# Altium project BRR_CB_P03_REV_A1_1-STM32MP157.PrjPcb (part 2 of 3)

## Sheet PowerSupply.SchDoc
size A3; SheetNumber: 6; SheetTotal: 14
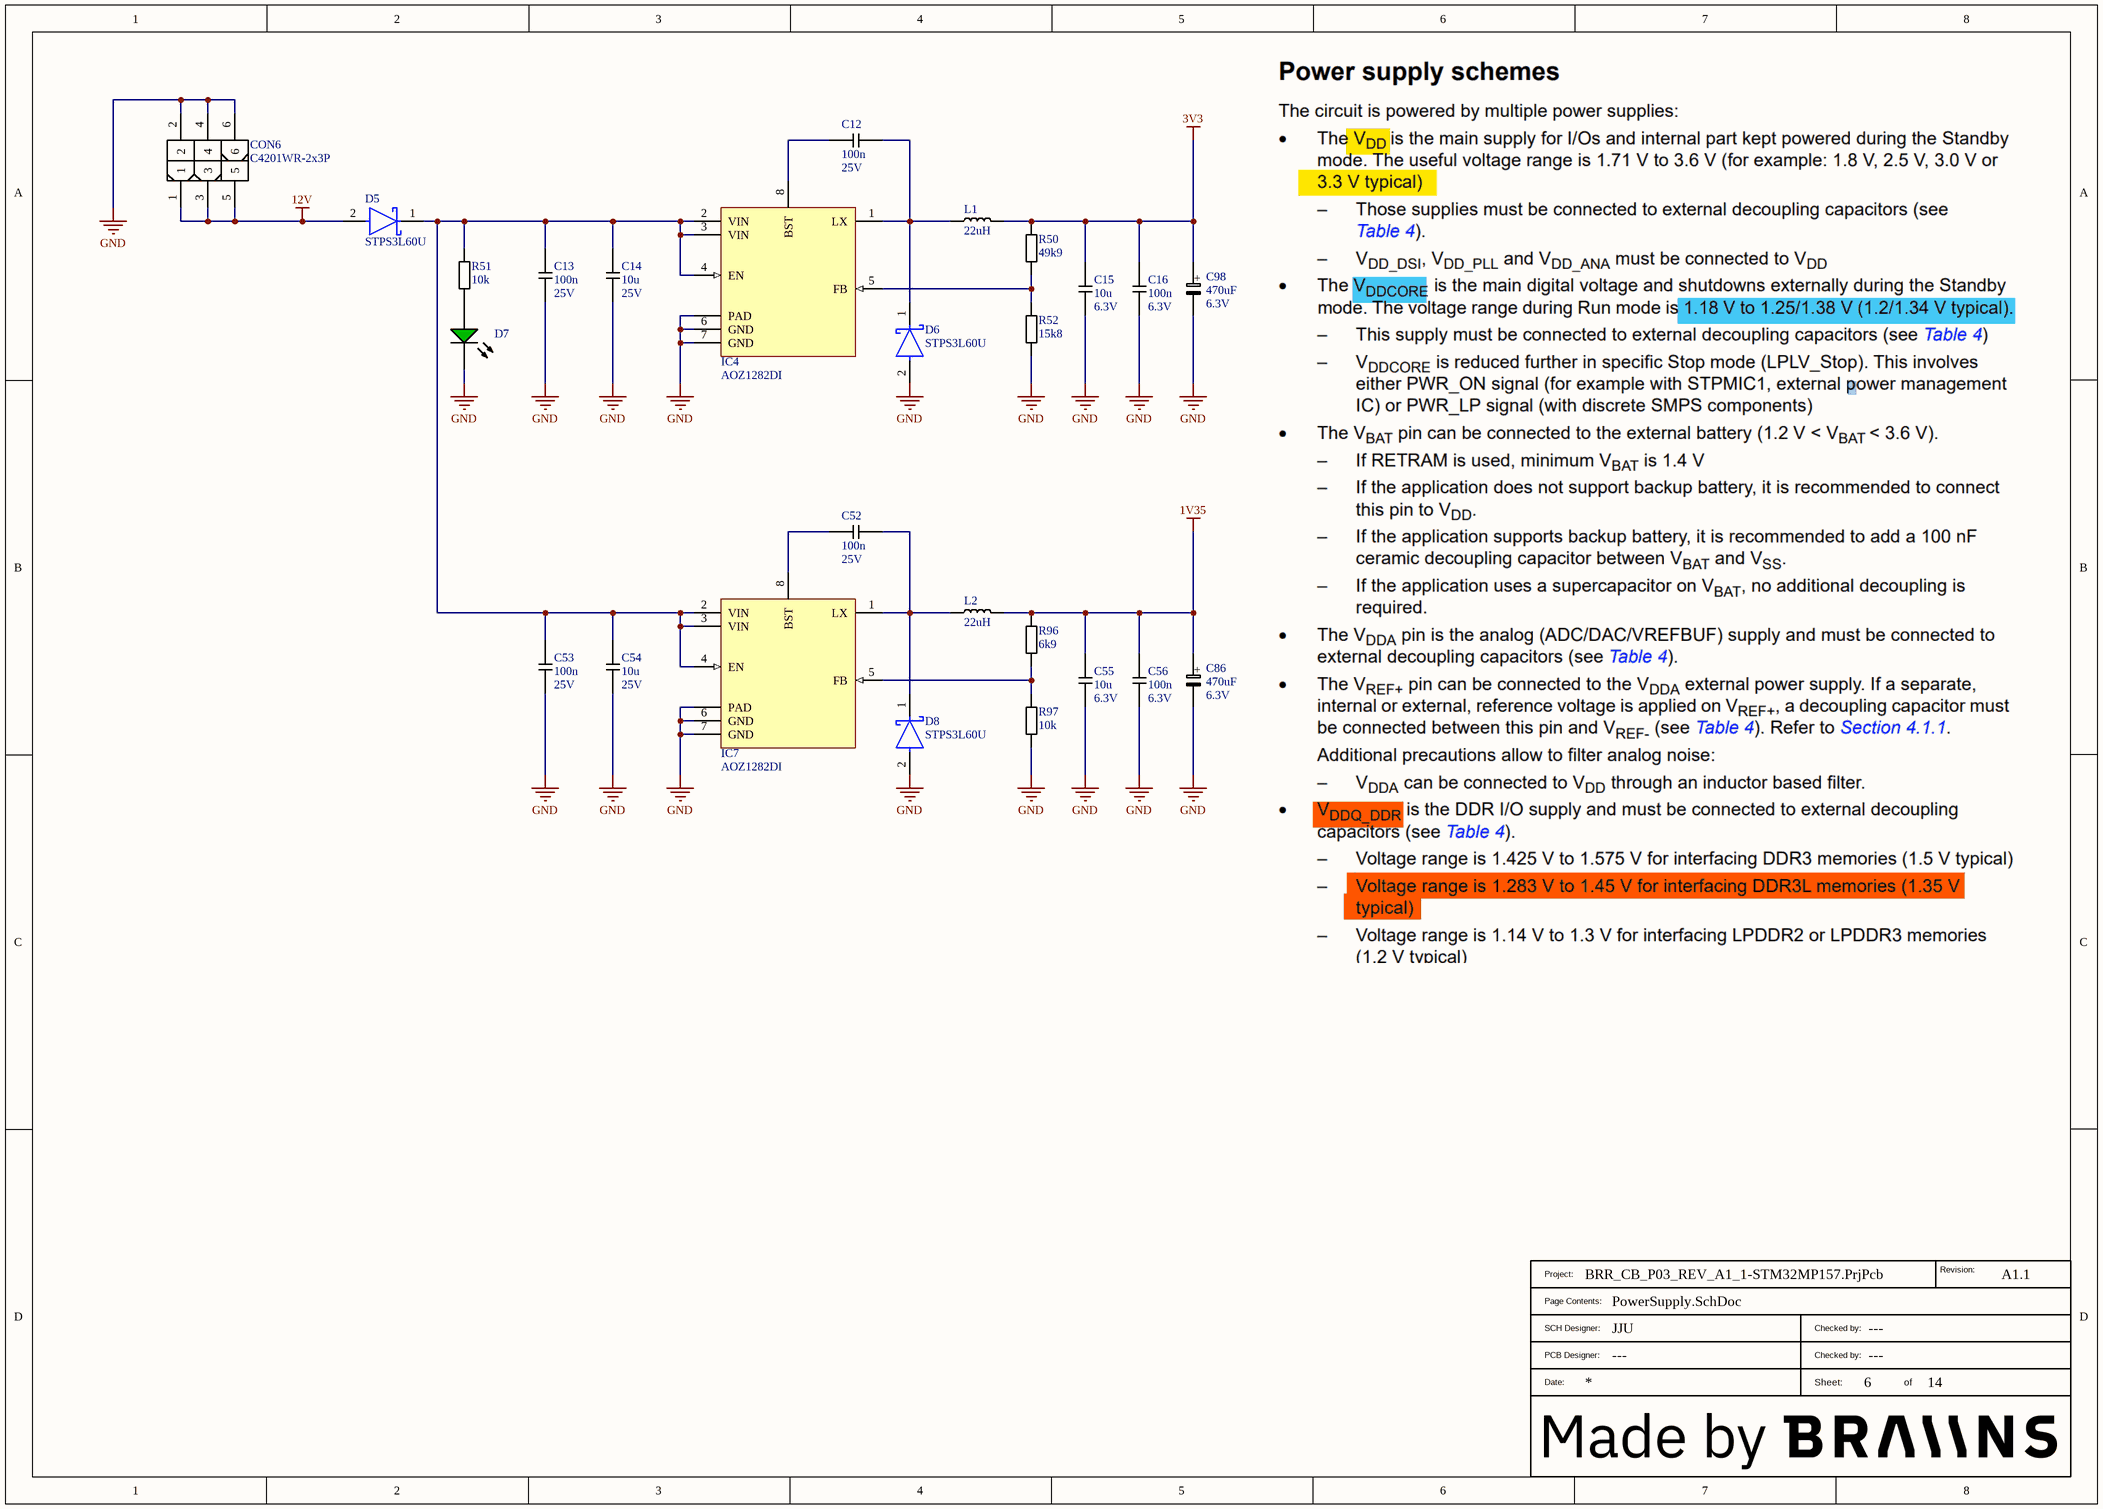
[diagram p4: PowerSupply.SchDoc]

### Parts
(Parts that share a designator on the sheet are numbered #1, #2 ... from top to bottom, then left to right.)
?#5  BraiinsTitleBlockWithLogo  (value not drawn)  (graphical)
C12  Voltage_Rating: 25V  [CAP0603]  (hidden comment: 100n)
C13  Voltage_Rating: 25V  [CAP0603]  (hidden comment: 100n)
C14  Voltage_Rating: 25V  [CAP1206]  (hidden comment: 10u)
C15  Voltage_Rating: 6.3V  [CAP0805]  (hidden comment: 10u)
C16  Voltage_Rating: 6.3V  [CAP0402]  (hidden comment: 100n)
C52  Voltage_Rating: 25V  [CAP0603]  (hidden comment: 100n)
C53  Voltage_Rating: 25V  [CAP0603]  (hidden comment: 100n)
C54  Voltage_Rating: 25V  [CAP1206]  (hidden comment: 10u)
C55  Voltage_Rating: 6.3V  [CAP0805]  (hidden comment: 10u)
C56  Voltage_Rating: 6.3V  [CAP0402]  (hidden comment: 100n)
C86  Voltage_Rating: 6.3V  [CAP_EEEFTJ471XAP]  (hidden comment: 470uF)
C98  Voltage_Rating: 6.3V  [CAP_EEEFTJ471XAP]  (hidden comment: 470uF)
CON6  C4201WR-2x3P  [MOLEX_39301061]
D5  STPS3L60U  [FP-SMB-MFG]
D6  STPS3L60U  [FP-SMB-MFG]
D7  FYLS-0603UGC  [AVAG-HSMX-C190_V]  (value not drawn)
D8  STPS3L60U  [FP-SMB-MFG]
IC4  AOZ1282DI  [DFN8_2X2]
IC7  AOZ1282DI  [DFN8_2X2]
L1  22uH  [VLS5045EX]
L2  22uH  [VLS5045EX]
R50  49k9  [RES0402]
R51  10k  [RES0603]
R52  15k8  [RES0402]
R96  6k9  [RES0402]
R97  10k  [RES0402]

### Nets
1V35: C55.1 C56.1 C86.1 L2.2 R96.1
3V3: C15.1 C16.1 C98.1 L1.2 R50.1
12V: CON6.1 CON6.3 CON6.5 D5.2(A)
GND: C13.2 C14.2 C15.2 C16.2 C53.2 C54.2 C55.2 C56.2 C86.2 C98.2 CON6.2 CON6.4 CON6.6 D6.2(A) D7.2(K) D8.2(A) IC4.6(GND) IC4.7(GND) IC4.PAD IC7.6(GND) IC7.7(GND) IC7.PAD R52.2 R97.2
NetC12_1: C12.1 IC4.8(BST)
NetC12_2: C12.2 D6.1(K) IC4.1(LX) L1.1
NetC13_1: C13.1 C14.1 C53.1 C54.1 D5.1(K) IC4.2(VIN) IC4.3(VIN) IC4.4(EN) IC7.2(VIN) IC7.3(VIN) IC7.4(EN) R51.1
NetC52_1: C52.1 IC7.8(BST)
NetC52_2: C52.2 D8.1(K) IC7.1(LX) L2.1
NetD7_1: D7.1(A) R51.2
NetIC4_5: IC4.5(FB) R50.2 R52.1
NetIC7_5: IC7.5(FB) R96.2 R97.1

### Notes on the sheet
- (in symbol 30239) +
- (in symbol BraiinsTitleBlockWithLogo) Revision:; Project:; Page Contents:; SCH Designer:; Checked by:; PCB Designer:; Date:; Sheet:; of

### Library data of the parts
C12 C13 C52 C53 = 30172: CAP CER 100n 10% 25V X7R 0603; Part_Type: Capacitor; Part_Status: New; ID: 30172; Updated By: janjuranek; Sorted_Value: 100; Value: 100n; Sub_Type: CER; Manufacturer Part Description: CAP CER 100n 10% 25V X7R 0603; Package_Case: 0603; RoHS: Yes; Dielectric: X7R; Tolerance: 10%; Created By: janjuranek; Created_Date: 2023-05-02 16:34:01; Updated_Date: 2023-05-02 16:34:23; ComponentLink1Description: Datasheet; ComponentLink2Description: Supplier Part Details
C14 C54 = 30171: CAP CER 10u 10% 25V X7R 1206; Part_Type: Capacitor; Part_Status: New; ID: 30171; Updated By: janjuranek; Sorted_Value: 10; Value: 10u; Sub_Type: CER; Manufacturer Part Description: CAP CER 10u 10% 25V X7R 1206; Package_Case: 1206; Dielectric: X7R; Tolerance: 10%; Created By: janjuranek; Created_Date: 2023-05-02 15:32:51; Updated_Date: 2023-05-02 15:37:12; ComponentLink1Description: Datasheet; ComponentLink2Description: Supplier Part Details
C15 C55 = 30174: CAP CER 10u 10% 6.3V X7R 0805; Part_Type: Capacitor; Part_Status: New; ID: 30174; Updated By: janjuranek; Sorted_Value: 10; Value: 10u; Sub_Type: CER; Manufacturer Part Description: CAP CER 10u 10% 6.3V X7R 0805; Package_Case: 0805; Dielectric: X7R; Tolerance: 10%; Created By: janjuranek; Created_Date: 2023-05-09 02:18:46; Updated_Date: 2023-05-09 02:19:22; ComponentLink1Description: Datasheet; ComponentLink2Description: Supplier Part Details; RoHS: Yes
C16 C56 = 30154: CAP CER 100n 10% 6.3V 0402; Part_Type: Capacitor; Part_Status: New; ID: 30154; Dielectric: X7R; Updated By: janjuranek; Sorted_Value: 100; Value: 100n; Sub_Type: CER; Manufacturer Part Description: CAP CER 100n 10% 6.3V 0402; Package_Case: 0402; RoHS: Yes; Tolerance: 10%; Created By: janjuranek; Created_Date: 2023-05-01 19:17:49; Updated_Date: 2023-05-01 19:19:14; ComponentLink1Description: Datasheet; ComponentLink2Description: Supplier Part Details
C86 C98 = 30239: CAP ELECT 470uF ±20% 6.3V Radial, Can - SMD; Part_Type: Capacitor; Manufacturer Part Number: EEE-FTJ471XAP; Manufacturer: Panasonic Electronic Components; Part_Status: New; ID: 30239; Sub_Type: POL; Updated By: janjuranek; Sorted_Value: 0,00047; Value: 470uF; Manufacturer Part Description: CAP ELECT 470uF ±20% 6.3V Radial, Can - SMD; Supplier 1: Digi-Key; Supplier Part Number 1: P15096TR-ND; Package_Case: Radial, Can - SMD; RoHS: Yes; Temperature Range: -55C to +105C; Tolerance: ±20%; Created By: janjuranek; Created_Date: 2023-10-13 11:39:12; Updated_Date: 2023-10-13 11:39:46; ComponentLink1Description: Datasheet; ComponentLink2Description: Supplier Part Details; ComponentLink2URL: https://www.digikey.com/products/en?keywords=EEE-FTJ471XAP
CON6 = 30196: CB Power Supply Connector; Manufacturer: CJT; Part_Status: New; ID: 30196; Updated By: janjuranek; Value: C4201WR-2x3P; Part_Type: Connector; Manufacturer Part Number: C4201WR-2x3P; Manufacturer Part Description: CB Power Supply Connector; Package_Case: THT; RoHS: Yes; Created By: janjuranek; Created_Date: 2023-06-06 15:12:03; Updated_Date: 2023-06-06 15:13:00; ComponentLink1Description: Datasheet; ComponentLink2Description: Supplier Part Details
D5 D6 D8 = CMP-12187-000023-1: DIODE SCHOTTKY 60V 3A SMB; Manufacturer: STMicroelectronics; Standoff Height: 0.05mm; Peak Reverse Current: 150uA; Max Junction Temp: +150°C; Max Surge Forward Current: 100A; Octopart: https://octopart.com/stps3l60u-stmicroelectronics-334329; Category: Diode; Height: 2.65mm; RoHS: TRUE; Mouser Description: Schottky diode Configuration: Single Housing type: DO-214AA=SMB Peak conducting-state current: 100 A; Forward Current: 3A; Manufacturer Part Number: STPS3L60U; Temperature: to +150°C; ComponentLink2URL: https://www.st.com/resource/en/datasheet/stps3l60.pdf; Max Repetitive Reverse Voltage: 60V; Device Class L1: Discrete Semiconductors; Automotive: No; Device Class L3: Schottky Diodes; Digikey Description: DIODE SCHOTTKY 60V 3A SMB; Lead Free: Yes; Temperature Range High: +150°C; Package: SMB; ComponentLink2Description: Datasheet; Device Class L2: Diodes
D7 = CMP-007-00013-2: LED Uni-Color Green, 52 mW, 20 mA, -40 to 85 degC, 2-Pin SMD, RoHS, Tape and Reel; Manufacturer: Avago; Forward Current: 20mA; Viewing Angle: 170degrees; Luminous Intensity: 15mcd; Lens Style: Diffused; Forward Voltage: 2.2V; Power: 52mW; Mounting Technology: SM; RoHS Compliant: True; Packaging: TapeandReel; Illumination Colour: Green; Datasheet URL: http://docs.avagotech.com/docs/AV02-0551EN; Min Operating Temperature: -40°C; Max Operating Temperature: 85°C; Pins: 2; Package Description: 2-Pin Surface Mount Device, Body 1.6 x 0.8 mm, Height 0.9 mm; Nominal Vf: 2.2V; Case/Package: 0603; Manufacturer URL: http://www.avagotech.com/; Datasheet Version: Mar-12; Colour: Green; Package Reference: HSMX-C190; Package Quantity: 4000
IC4 IC7 = 30108: 1.2A buck regulator, 4.5V to 36V, 450kHz; Part_Type: IC; Manufacturer: Alpha & Omeha; Part_Status: New; ID: 30108; Updated By: janjuranek; Value: AOZ1282DI; Manufacturer Part Number: AOZ1282DI; Manufacturer Part Description: 1.2A buck regulator, 4.5V to 36V, 450kHz; Package_Case: DFN8_2x2; RoHS: Yes; Created By: janjuranek; Created_Date: 2023-03-15 10:24:18; Updated_Date: 2023-03-15 10:26:02; ComponentLink1Description: Datasheet; ComponentLink2Description: Supplier Part Details
L1 L2 = 30147: INDUCTOR 22uH ±20% 1.8A; Manufacturer Part Number: VLS5045EX-220M-H; Manufacturer: TDK Corporation; Part_Status: New; ID: 30147; Updated By: janjuranek; Sorted_Value: 2,2E-5; Value: 22uH; Part_Type: Inductor; Manufacturer Part Description: INDUCTOR 22uH ±20% 1.8A; Supplier 1: Digi-Key; Supplier Part Number 1: 445-181623-2-ND; RoHS: Yes; Temperature Range: -40C to +125C; Tolerance: ±20%; Current_Rating: 1.8A; Created By: janjuranek; Created_Date: 2023-04-25 13:27:45; Updated_Date: 2023-04-25 13:28:20; ComponentLink1Description: Datasheet; ComponentLink2Description: Supplier Part Details; ComponentLink2URL: https://www.digikey.com/products/en?keywords=VLS5045EX-220M-H
R50 = 30164: RES 49k9 Ohm 1% 0402; Part_Status: New; ID: 30164; Updated By: janjuranek; Sorted_Value: 49; Value: 49k9; Part_Type: Resistor; Manufacturer Part Description: RES 49k9 Ohm 1% 0402; Package_Case: 0402; RoHS: Yes; Tolerance: 1%; Created By: janjuranek; Created_Date: 2023-05-01 19:45:19; Updated_Date: 2023-05-01 19:45:33; ComponentLink1Description: Datasheet; ComponentLink2Description: Supplier Part Details
R51 = 30092: RES 10k Ohm 1% 0603; Part_Status: New; ID: 30092; Updated By: janjuranek; Sorted_Value: 10000; Value: 10k; Part_Type: Resistor; Manufacturer Part Description: RES 10k Ohm 1% 0603; Package_Case: 0603; RoHS: Yes; Tolerance: 1%; Created By: janjuranek; Created_Date: 2023-03-07 16:44:40; Updated_Date: 2023-03-07 16:45:08; ComponentLink1Description: Datasheet; ComponentLink2Description: Supplier Part Details
R52 = 30165: RES 15k8 Ohm 1% 0402; Part_Status: New; ID: 30165; Updated By: janjuranek; Sorted_Value: 15; Value: 15k8; Part_Type: Resistor; Manufacturer Part Description: RES 15k8 Ohm 1% 0402; Package_Case: 0402; RoHS: Yes; Tolerance: 1%; Created By: janjuranek; Created_Date: 2023-05-01 19:45:37; Updated_Date: 2023-05-01 19:45:52; ComponentLink1Description: Datasheet; ComponentLink2Description: Supplier Part Details
R96 = 30153: RES 6k9 Ohm 1% 0402; Part_Status: New; ID: 30153; Updated By: janjuranek; Sorted_Value: 6; Value: 6k9; Part_Type: Resistor; Manufacturer Part Description: RES 6k9 Ohm 1% 0402; Package_Case: 0402; RoHS: Yes; Tolerance: 1%; Created By: janjuranek; Created_Date: 2023-05-01 18:44:43; Updated_Date: 2023-05-01 18:45:19; ComponentLink1Description: Datasheet; ComponentLink2Description: Supplier Part Details
R97 = 30071: RES 10k Ohm 1% 0402; Part_Status: New; ID: 30071; Updated By: Jan; Sorted_Value: 10000; Value: 10k; Part_Type: Resistor; Manufacturer Part Description: RES 10k Ohm 1% 0402; Package_Case: 0402; RoHS: Yes; Tolerance: 1%; Created By: Jan; Created_Date: 2023-03-02 13:13:56; Updated_Date: 2023-03-02 13:14:31; ComponentLink1Description: Datasheet; ComponentLink2Description: Supplier Part Details; Temperature Range: -40 to +150C

## Sheet SDCard.SchDoc
size A4; SheetNumber: 5; SheetTotal: 14
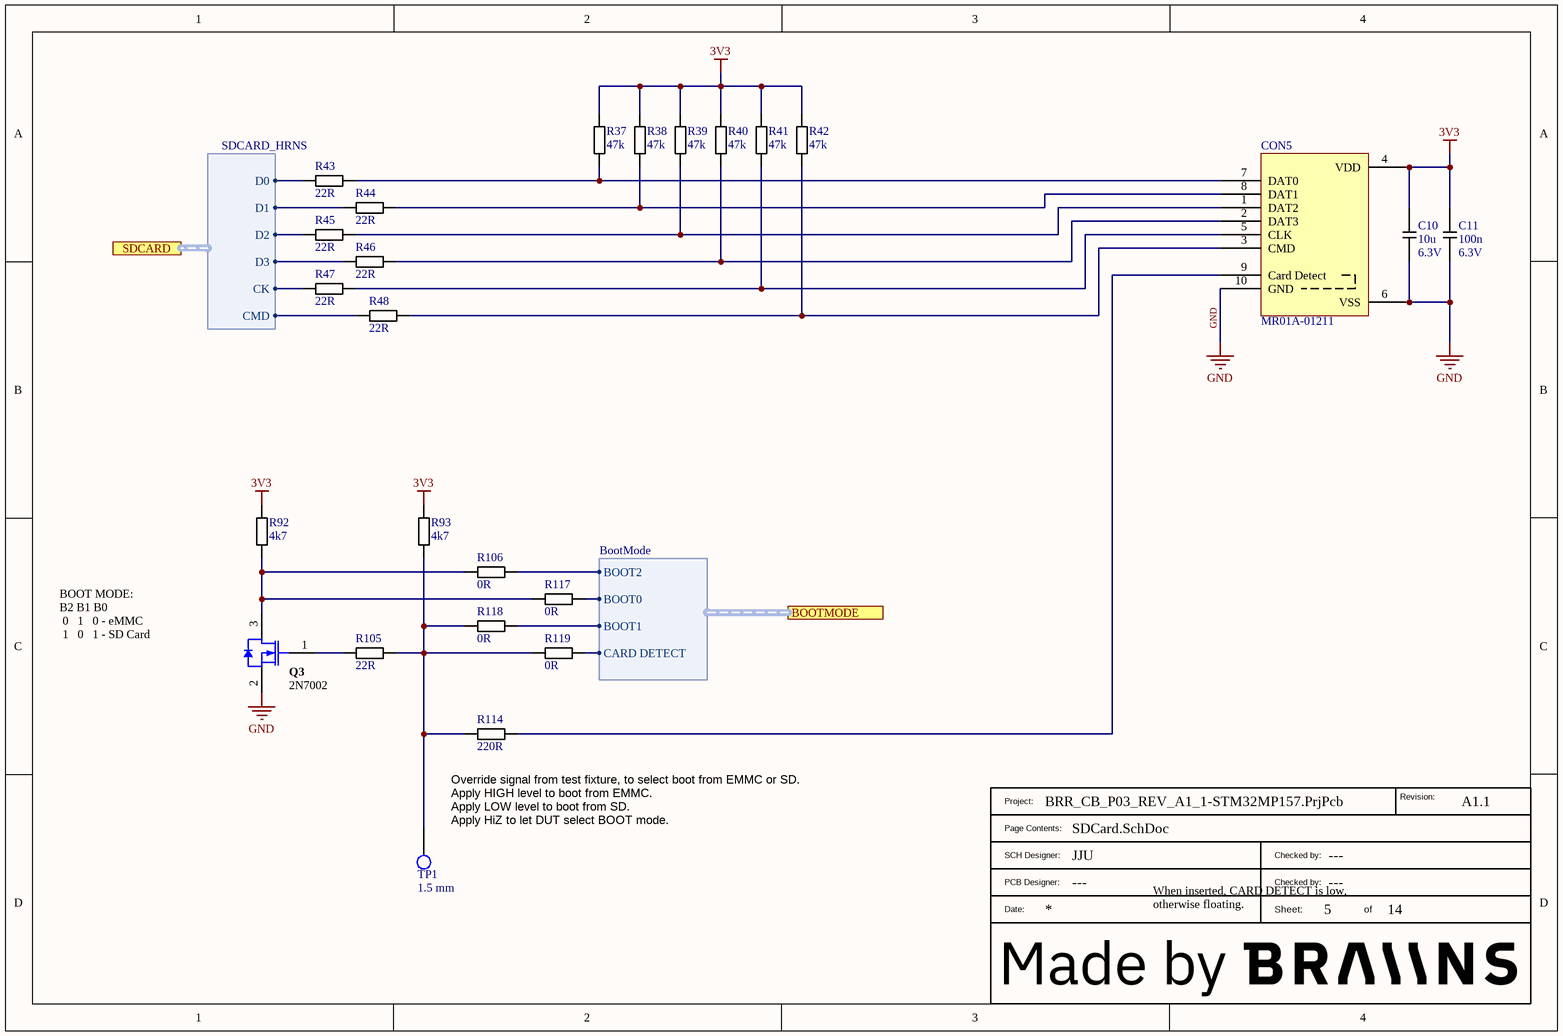
[diagram p5: SDCard.SchDoc]

### Parts
(Parts that share a designator on the sheet are numbered #1, #2 ... from top to bottom, then left to right.)
?#6  BraiinsTitleBlockWithLogo  (value not drawn)  (graphical)
C10  Voltage_Rating: 6.3V  [CAP0805]  (hidden comment: 10u)
C11  Voltage_Rating: 6.3V  [CAP0402]  (hidden comment: 100n)
CON5  MR01A-01211  [MR01A01211]
Q3  2N7002  [INF-PG-SOT23_M]
R37  47k  [RES0402]
R38  47k  [RES0402]
R39  47k  [RES0402]
R40  47k  [RES0402]
R41  47k  [RES0402]
R42  47k  [RES0402]
R43  22R  [RES0402]
R44  22R  [RES0402]
R45  22R  [RES0402]
R46  22R  [RES0402]
R47  22R  [RES0402]
R48  22R  [RES0402]
R92  4k7  [RES0402]
R93  4k7  [RES0402]
R105  22R  [RES0402]
R106  0R  [RES0402]
R114  220R  [RES0402]
R117  0R  [RES0402]
R118  0R  [RES0402]
R119  0R  [RES0402]
TP1  1.5 mm  [TESTPOINT_1_5MM]

### Ports
BOOTMODE (harness BootMode), SDCARD (harness SDCARD_HRNS)

### Harnesses
SDCARD_HRNS: CK, CMD, D0, D1, D2, D3
BootMode: BOOT2, BOOT0, BOOT1, CARD DETECT

### Nets
3V3: C10.1 C11.1 CON5.4(VDD) R37.1 R38.1 R39.1 R40.1 R41.1 R42.1 R92.1 R93.1
GND: C10.2 C11.2 CON5.6(VSS) CON5.10(GND) Q3.2(SOURCE)
BOOT0: R117.2 ; port BOOTMODE.BOOT0
BOOT1: R118.2 ; port BOOTMODE.BOOT1
BOOT2: R106.2 ; port BOOTMODE.BOOT2
CARD_DETECT: R119.2 ; port BOOTMODE.CARD DETECT
SDMMC1_CK: R47.1 ; port SDCARD.CK
SDMMC1_CMD: R48.1 ; port SDCARD.CMD
SDMMC1_D0: R43.1 ; port SDCARD.D0
SDMMC1_D1: R44.1 ; port SDCARD.D1
SDMMC1_D2: R45.1 ; port SDCARD.D2
SDMMC1_D3: R46.1 ; port SDCARD.D3
NetCON5_1: CON5.1(DAT2) R39.2 R45.2
NetCON5_2: CON5.2(DAT3) R40.2 R46.2
NetCON5_3: CON5.3(CMD) R42.2 R48.2
NetCON5_5: CON5.5(CLK) R41.2 R47.2
NetCON5_7: CON5.7(DAT0) R37.2 R43.2
NetCON5_8: CON5.8(DAT1) R38.2 R44.2
NetCON5_9: CON5.9(Card_Detect) R114.2
NetQ3_1: Q3.1(GATE) R105.1
NetQ3_3: Q3.3(DRAIN) R92.2 R106.1 R117.1
NetR93_2: R93.2 R105.2 R114.1 R118.1 R119.1 TP1.1

### Notes on the sheet
- BOOT MODE:
  B2 B1 B0
  0   1   0 - eMMC
  1   0   1 - SD Card
- (near R114) Override signal from test fixture, to select boot from EMMC or SD.
- Apply HIGH level to boot from EMMC.
- Apply LOW level to boot from SD.
- (near TP1) Apply HiZ to let DUT select BOOT mode.
- When inserted, CARD DETECT is low, otherwise floating.
- (in symbol BraiinsTitleBlockWithLogo) Revision:; Project:; Page Contents:; SCH Designer:; Checked by:; PCB Designer:; Date:; Sheet:; of

### Library data of the parts
C10 = 30174: as C15 on sheet PowerSupply; Value: 10u; Sub_Type: CER; Manufacturer Part Description: CAP CER 10u 10% 6.3V X7R 0805; Package_Case: 0805; RoHS: Yes; Dielectric: X7R; Tolerance: 10%; Created By: janjuranek; Created_Date: 2023-05-09 02:18:46; Updated_Date: 2023-05-09 02:19:22; ComponentLink1Description: Datasheet; ComponentLink2Description: Supplier Part Details
C11 = 30154: as C16 on sheet PowerSupply; Value: 100n; Sub_Type: CER; Manufacturer Part Description: CAP CER 100n 10% 6.3V 0402; Package_Case: 0402; RoHS: Yes; Tolerance: 10%; Created By: janjuranek; Created_Date: 2023-05-01 19:17:49; Updated_Date: 2023-05-01 19:19:14; ComponentLink1Description: Datasheet; ComponentLink2Description: Supplier Part Details
CON5 = 30104: Micro SD card connector with card detect; Part_Status: New; ID: 30104; Updated By: janjuranek; Value: MR01A-01211; Part_Type: Connector; Manufacturer Part Number: MR01A-01211; Manufacturer Part Description: Micro SD card connector with card detect; RoHS: Yes; Created By: janjuranek; Created_Date: 2023-03-14 04:17:57; Updated_Date: 2023-03-22 18:19:20; ComponentLink1Description: Datasheet; ComponentLink2Description: Supplier Part Details; ComponentLink1URL: ATOM-TECH-MR01A-01211.pdf
Q3 = CMP-1149-00026-1: N-Channel OptiMOS Small-Signal-Transistor, 60 V VDS, 0.3 A ID, -55 to 150 degC, PG-SOT23, Reel, Green; Manufacturer: Infineon; RDS (on) (max) (@4.5V): 4,000 mOhm; VDS (max): 60 V; IDpuls (max): 1.2Â A; QG: 0.4Â nC; RDS (on) (max): 3,000 mOhm; RthJA (max): 250 K/W; ID (max): 0.3Â A; VGS(th) (max): 2.5Â V; VGS(th) (min): 1.5Â V; Green: TRUE; Ptot (max): 0.5Â W; PackageDescription: 3-Pin Small Outline Transistor Package, 2.9 x 1.3 mm Body, 0.95 mm Pitch; Halogen-free: TRUE; ComponentLink2Description: Datasheet; ComponentLink1URL: http://www.infineon.com/; Packing: Reel; DatasheetVersion: Rev. 2.4; PartNumber: 2N7002; PackageReference: PG-SOT23; PackageVersion: Apr-08; ComponentLink3URL: http://www.infineon.com/dgdl/SOT23-Package_Overview.pdf?folderId=db3a30431936bc4b0119532290053c66&fileId=db3a30431936bc4b0119533468123c85; ComponentLink1Description: Manufacturer URL; Mounting Technology: Surface Mount; ComponentLink3Description: Package Specification; ComponentLink2URL: http://www.infineon.com/dgdl/2N7002_Rev2.4.pdf?folderId=db3a3043156fd573011622e10b5c1f67&fileId=db3a304319bc939a0119c2a9461e79e6
R37-R42 = 30157: RES 47k Ohm 1% 0402; Part_Status: New; ID: 30157; Updated By: janjuranek; Sorted_Value: 47000; Value: 47k; Part_Type: Resistor; Manufacturer Part Description: RES 47k Ohm 1% 0402; Package_Case: 0402; Tolerance: 1%; Created By: janjuranek; Created_Date: 2023-05-01 19:31:45; Updated_Date: 2023-05-01 19:31:58; ComponentLink1Description: Datasheet; ComponentLink2Description: Supplier Part Details; RoHS: Yes
R43-R48 R105 = 30156: RES 22R Ohm 1% 0402; Part_Status: New; ID: 30156; Updated By: janjuranek; Sorted_Value: 22; Value: 22R; Part_Type: Resistor; Manufacturer Part Description: RES 22R Ohm 1% 0402; Package_Case: 0402; Tolerance: 1%; Created By: janjuranek; Created_Date: 2023-05-01 19:29:39; Updated_Date: 2023-05-01 19:30:05; ComponentLink1Description: Datasheet; ComponentLink2Description: Supplier Part Details; RoHS: Yes
R92 R93 = 30073: as R107 on sheet MPU; Value: 4k7; Part_Type: Resistor; Manufacturer Part Description: RES 4k7 Ohm 1% 0402; Package_Case: 0402; RoHS: Yes; Temperature Range: -40 to +150C; Tolerance: 1%; Created By: Jan; Created_Date: 2023-03-02 13:15:12; Updated_Date: 2023-03-02 13:15:46; ComponentLink1Description: Datasheet; ComponentLink2Description: Supplier Part Details
R106 R117-R119 = 30178: RES 0R Ohm 1% 0402; Part_Status: New; ID: 30178; Updated By: janjuranek; Sorted_Value: 0; Value: 0R; Part_Type: Resistor; Manufacturer Part Description: RES 0R Ohm 1% 0402; Package_Case: 0402; RoHS: Yes; Tolerance: 1%; Created By: janjuranek; Created_Date: 2023-05-15 08:47:05; Updated_Date: 2023-05-15 08:47:18; ComponentLink1Description: Datasheet; ComponentLink2Description: Supplier Part Details
R114 = 30216: RES 220R Ohm 1% 0402; Part_Status: New; ID: 30216; Updated By: janjuranek; Sorted_Value: 220; Value: 220R; Part_Type: Resistor; Manufacturer Part Description: RES 220R Ohm 1% 0402; Package_Case: 0402; RoHS: Yes; Tolerance: 1%; Created By: janjuranek; Created_Date: 2023-08-08 14:57:40; Updated_Date: 2023-08-08 14:57:56; ComponentLink1Description: Datasheet; ComponentLink2Description: Supplier Part Details
TP1 = 30199: Testpoint SMT 1.5mm; Part_Status: New; ID: 30199; Updated By: janjuranek; Value: 1.5 mm; Part_Type: Testpoint; Manufacturer Part Description: Testpoint SMT 1.5mm; Created By: janjuranek; Created_Date: 2023-06-22 13:58:58; Updated_Date: 2023-06-22 14:00:13; ComponentLink1Description: Datasheet; ComponentLink2Description: Supplier Part Details

## Sheet EMMC.SchDoc
size A3; SheetNumber: 7; SheetTotal: 14
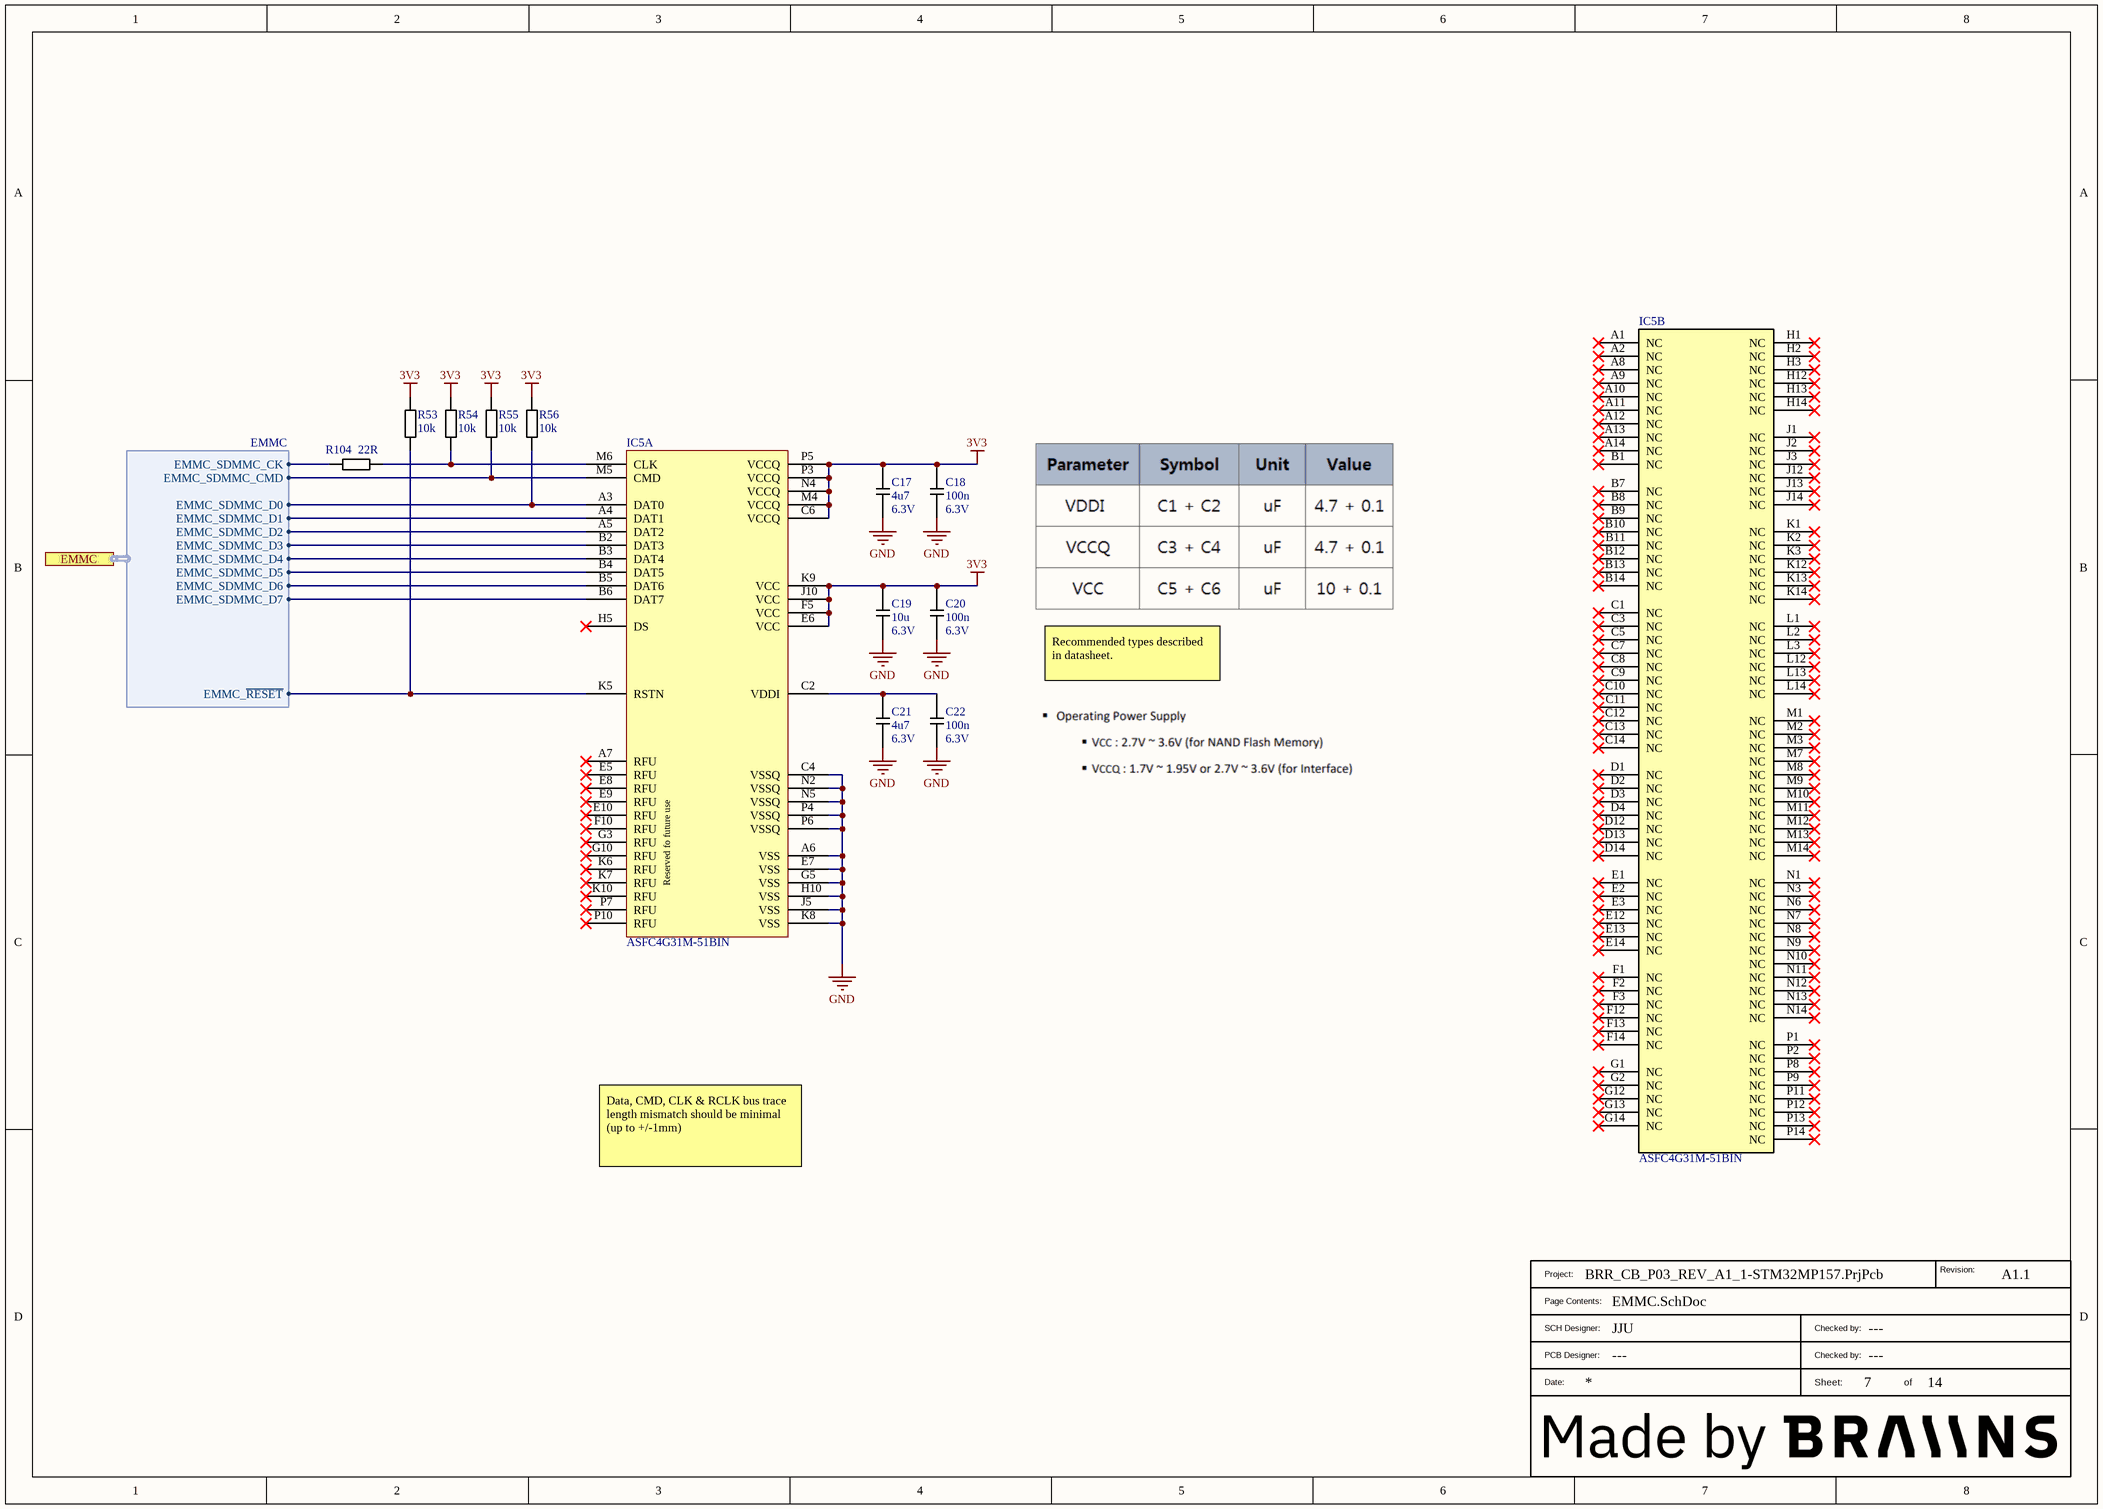
[diagram p6: EMMC.SchDoc]

### Parts
(Parts that share a designator on the sheet are numbered #1, #2 ... from top to bottom, then left to right.)
?#7  BraiinsTitleBlockWithLogo  (value not drawn)  (graphical)
C17  Voltage_Rating: 6.3V  [CAP0805]  (hidden comment: 4u7)
C18  Voltage_Rating: 6.3V  [CAP0603]  (hidden comment: 100n)
C19  Voltage_Rating: 6.3V  [CAP0805]  (hidden comment: 10u)
C20  Voltage_Rating: 6.3V  [CAP0603]  (hidden comment: 100n)
C21  Voltage_Rating: 6.3V  [CAP0805]  (hidden comment: 4u7)
C22  Voltage_Rating: 6.3V  [CAP0603]  (hidden comment: 100n)
IC5  ASFC4G31M-51BIN  [BGA153C50P14X14_1150X1300X100]  (parts A,B of 2)
R53  10k  [RES0402]
R54  10k  [RES0402]
R55  10k  [RES0402]
R56  10k  [RES0402]
R104  22R  [RES0402]

### Ports
EMMC (harness EMMC)

### Harnesses
EMMC: EMMC_SDMMC_CK, EMMC_SDMMC_CMD, EMMC_SDMMC_D0, EMMC_SDMMC_D1, EMMC_SDMMC_D2, EMMC_SDMMC_D3, EMMC_SDMMC_D4, EMMC_SDMMC_D5, EMMC_SDMMC_D6, EMMC_SDMMC_D7, EMMC_~{RESET}

### Nets
3V3: C17.1 C18.1 C19.1 C20.1 IC5.C6(VCCQ) IC5.E6(VCC) IC5.F5(VCC) IC5.J10(VCC) IC5.K9(VCC) IC5.M4(VCCQ) IC5.N4(VCCQ) IC5.P3(VCCQ) IC5.P5(VCCQ) R53.1 R54.1 R55.1 R56.1
GND: C17.2 C18.2 C19.2 C20.2 C21.2 C22.2 IC5.A6(VSS) IC5.C4(VSSQ) IC5.E7(VSS) IC5.G5(VSS) IC5.H10(VSS) IC5.J5(VSS) IC5.K8(VSS) IC5.N2(VSSQ) IC5.N5(VSSQ) IC5.P4(VSSQ) IC5.P6(VSSQ)
EMMC_RESET: IC5.K5(RSTN) R53.2 ; port EMMC.EMMC_~{RESET}
SDMMC2_CK: R104.1 ; port EMMC.EMMC_SDMMC_CK
SDMMC2_CMD: IC5.M5(CMD) R55.2 ; port EMMC.EMMC_SDMMC_CMD
SDMMC2_D0: IC5.A3(DAT0) R56.2 ; port EMMC.EMMC_SDMMC_D0
SDMMC2_D1: IC5.A4(DAT1) ; port EMMC.EMMC_SDMMC_D1
SDMMC2_D2: IC5.A5(DAT2) ; port EMMC.EMMC_SDMMC_D2
SDMMC2_D3: IC5.B2(DAT3) ; port EMMC.EMMC_SDMMC_D3
SDMMC2_D4: IC5.B3(DAT4) ; port EMMC.EMMC_SDMMC_D4
SDMMC2_D5: IC5.B4(DAT5) ; port EMMC.EMMC_SDMMC_D5
SDMMC2_D6: IC5.B5(DAT6) ; port EMMC.EMMC_SDMMC_D6
SDMMC2_D7: IC5.B6(DAT7) ; port EMMC.EMMC_SDMMC_D7
NetC21_1: C21.1 C22.1 IC5.C2(VDDI)
NetIC5_M6: IC5.M6(CLK) R54.2 R104.2

Not connected (* = marked no-connect by the designer): IC5 A1(NC)* A2(NC)* A7(RFU)* A8(NC)* A9(NC)* A10(NC)* A11(NC)* A12(NC)* A13(NC)* A14(NC)* B1(NC)* B7(NC)* B8(NC)* B9(NC)* B10(NC)* B11(NC)* B12(NC)* B13(NC)* B14(NC)* C1(NC)* C3(NC)* C5(NC)* C7(NC)* C8(NC)* C9(NC)* C10(NC)* C11(NC)* C12(NC)* C13(NC)* C14(NC)* D1(NC)* D2(NC)* D3(NC)* D4(NC)* D12(NC)* D13(NC)* D14(NC)* E1(NC)* E2(NC)* E3(NC)* E5(RFU)* E8(RFU)* E9(RFU)* E10(RFU)* E12(NC)* E13(NC)* E14(NC)* F1(NC)* F2(NC)* F3(NC)* F10(RFU)* F12(NC)* F13(NC)* F14(NC)* G1(NC)* G2(NC)* G3(RFU)* G10(RFU)* G12(NC)* G13(NC)* G14(NC)* H1(NC)* H2(NC)* H3(NC)* H5(DS)* H12(NC)* H13(NC)* H14(NC)* J1(NC)* J2(NC)* J3(NC)* J12(NC)* J13(NC)* J14(NC)* K1(NC)* K2(NC)* K3(NC)* K6(RFU)* K7(RFU)* K10(RFU)* K12(NC)* K13(NC)* K14(NC)* L1(NC)* L2(NC)* L3(NC)* L12(NC)* L13(NC)* L14(NC)* M1(NC)* M2(NC)* M3(NC)* M7(NC)* M8(NC)* M9(NC)* M10(NC)* M11(NC)* M12(NC)* M13(NC)* M14(NC)* N1(NC)* N3(NC)* N6(NC)* N7(NC)* N8(NC)* N9(NC)* N10(NC)* N11(NC)* N12(NC)* N13(NC)* N14(NC)* P1(NC)* P2(NC)* P7(RFU)* P8(NC)* P9(NC)* P10(RFU)* P11(NC)* P12(NC)* P13(NC)* P14(NC)*

### Notes on the sheet
- Recommended types described in datasheet.
- Data, CMD, CLK & RCLK bus trace length mismatch should be minimal (up to +/-1mm)
- (in symbol 30134, part A) Reserved fo future use
- (in symbol BraiinsTitleBlockWithLogo) Revision:; Project:; Page Contents:; SCH Designer:; Checked by:; PCB Designer:; Date:; Sheet:; of

### Library data of the parts
C17 C21 = 30175: CAP CER 4u7 10% 6.3V X7R 0805; Part_Type: Capacitor; Part_Status: New; ID: 30175; Updated By: janjuranek; Sorted_Value: 4; Value: 4u7; Sub_Type: CER; Manufacturer Part Description: CAP CER 4u7 10% 6.3V X7R 0805; Package_Case: 0805; RoHS: Yes; Dielectric: X7R; Tolerance: 10%; Created By: janjuranek; Created_Date: 2023-05-09 02:30:59; Updated_Date: 2023-05-09 02:31:25; ComponentLink1Description: Datasheet; ComponentLink2Description: Supplier Part Details
C18 C20 C22 = 30140: CAP CER 100n 10% 6.3V X7R 0603; Part_Type: Capacitor; Part_Status: New; ID: 30140; Updated By: janjuranek; Sorted_Value: 100; Value: 100n; Sub_Type: CER; Manufacturer Part Description: CAP CER 100n 10% 6.3V X7R 0603; Package_Case: 0603; RoHS: Yes; Dielectric: X7R; Tolerance: 10%; Created By: janjuranek; Created_Date: 2023-04-12 21:44:35; Updated_Date: 2023-04-12 21:45:00; ComponentLink1Description: Datasheet; ComponentLink2Description: Supplier Part Details
C19 = 30174: as C15 on sheet PowerSupply; Value: 10u; Sub_Type: CER; Manufacturer Part Description: CAP CER 10u 10% 6.3V X7R 0805; Package_Case: 0805; RoHS: Yes; Dielectric: X7R; Tolerance: 10%; Created By: janjuranek; Created_Date: 2023-05-09 02:18:46; Updated_Date: 2023-05-09 02:19:22; ComponentLink1Description: Datasheet; ComponentLink2Description: Supplier Part Details
IC5 = 30134: IC FLASH 4GB MMC 153FBGA; Manufacturer: Alliance Memory, Inc.; Part_Status: New; ID: 30134; Updated By: janjuranek; Value: ASFC4G31M-51BIN; Part_Type: IC; Manufacturer Part Number: ASFC4G31M-51BIN; Manufacturer Part Description: IC FLASH 4GB MMC 153FBGA; Supplier 1: Digi-Key; Supplier Part Number 1: 1450-ASFC4G31M-51BIN-ND; Package_Case: 153-VFBGA; RoHS: Yes; Temperature Range: -40C to +85C (TA); Created By: janjuranek; Created_Date: 2023-04-11 10:19:35; Updated_Date: 2023-05-19 16:28:37; ComponentLink1Description: Datasheet; ComponentLink2Description: Supplier Part Details; ComponentLink2URL: https://www.digikey.com/products/en?keywords=ASFC4G31M-51BIN
R53-R56 = 30071: as R97 on sheet PowerSupply; Value: 10k; Part_Type: Resistor; Manufacturer Part Description: RES 10k Ohm 1% 0402; Package_Case: 0402; RoHS: Yes; Tolerance: 1%; Created By: Jan; Created_Date: 2023-03-02 13:13:56; Updated_Date: 2023-03-02 13:14:31; ComponentLink1Description: Datasheet; ComponentLink2Description: Supplier Part Details; Temperature Range: -40 to +150C
R104 = 30156: as R43 on sheet SDCard; Value: 22R; Part_Type: Resistor; Manufacturer Part Description: RES 22R Ohm 1% 0402; Package_Case: 0402; RoHS: Yes; Tolerance: 1%; Created By: janjuranek; Created_Date: 2023-05-01 19:29:39; Updated_Date: 2023-05-01 19:30:05; ComponentLink1Description: Datasheet; ComponentLink2Description: Supplier Part Details

## Sheet RAM.SchDoc
size A3; SheetNumber: 9; SheetTotal: 14; SPICEModelCachePWQIORAL: <root> / <DocumentId>PWQIORAL</DocumentId> / </root>
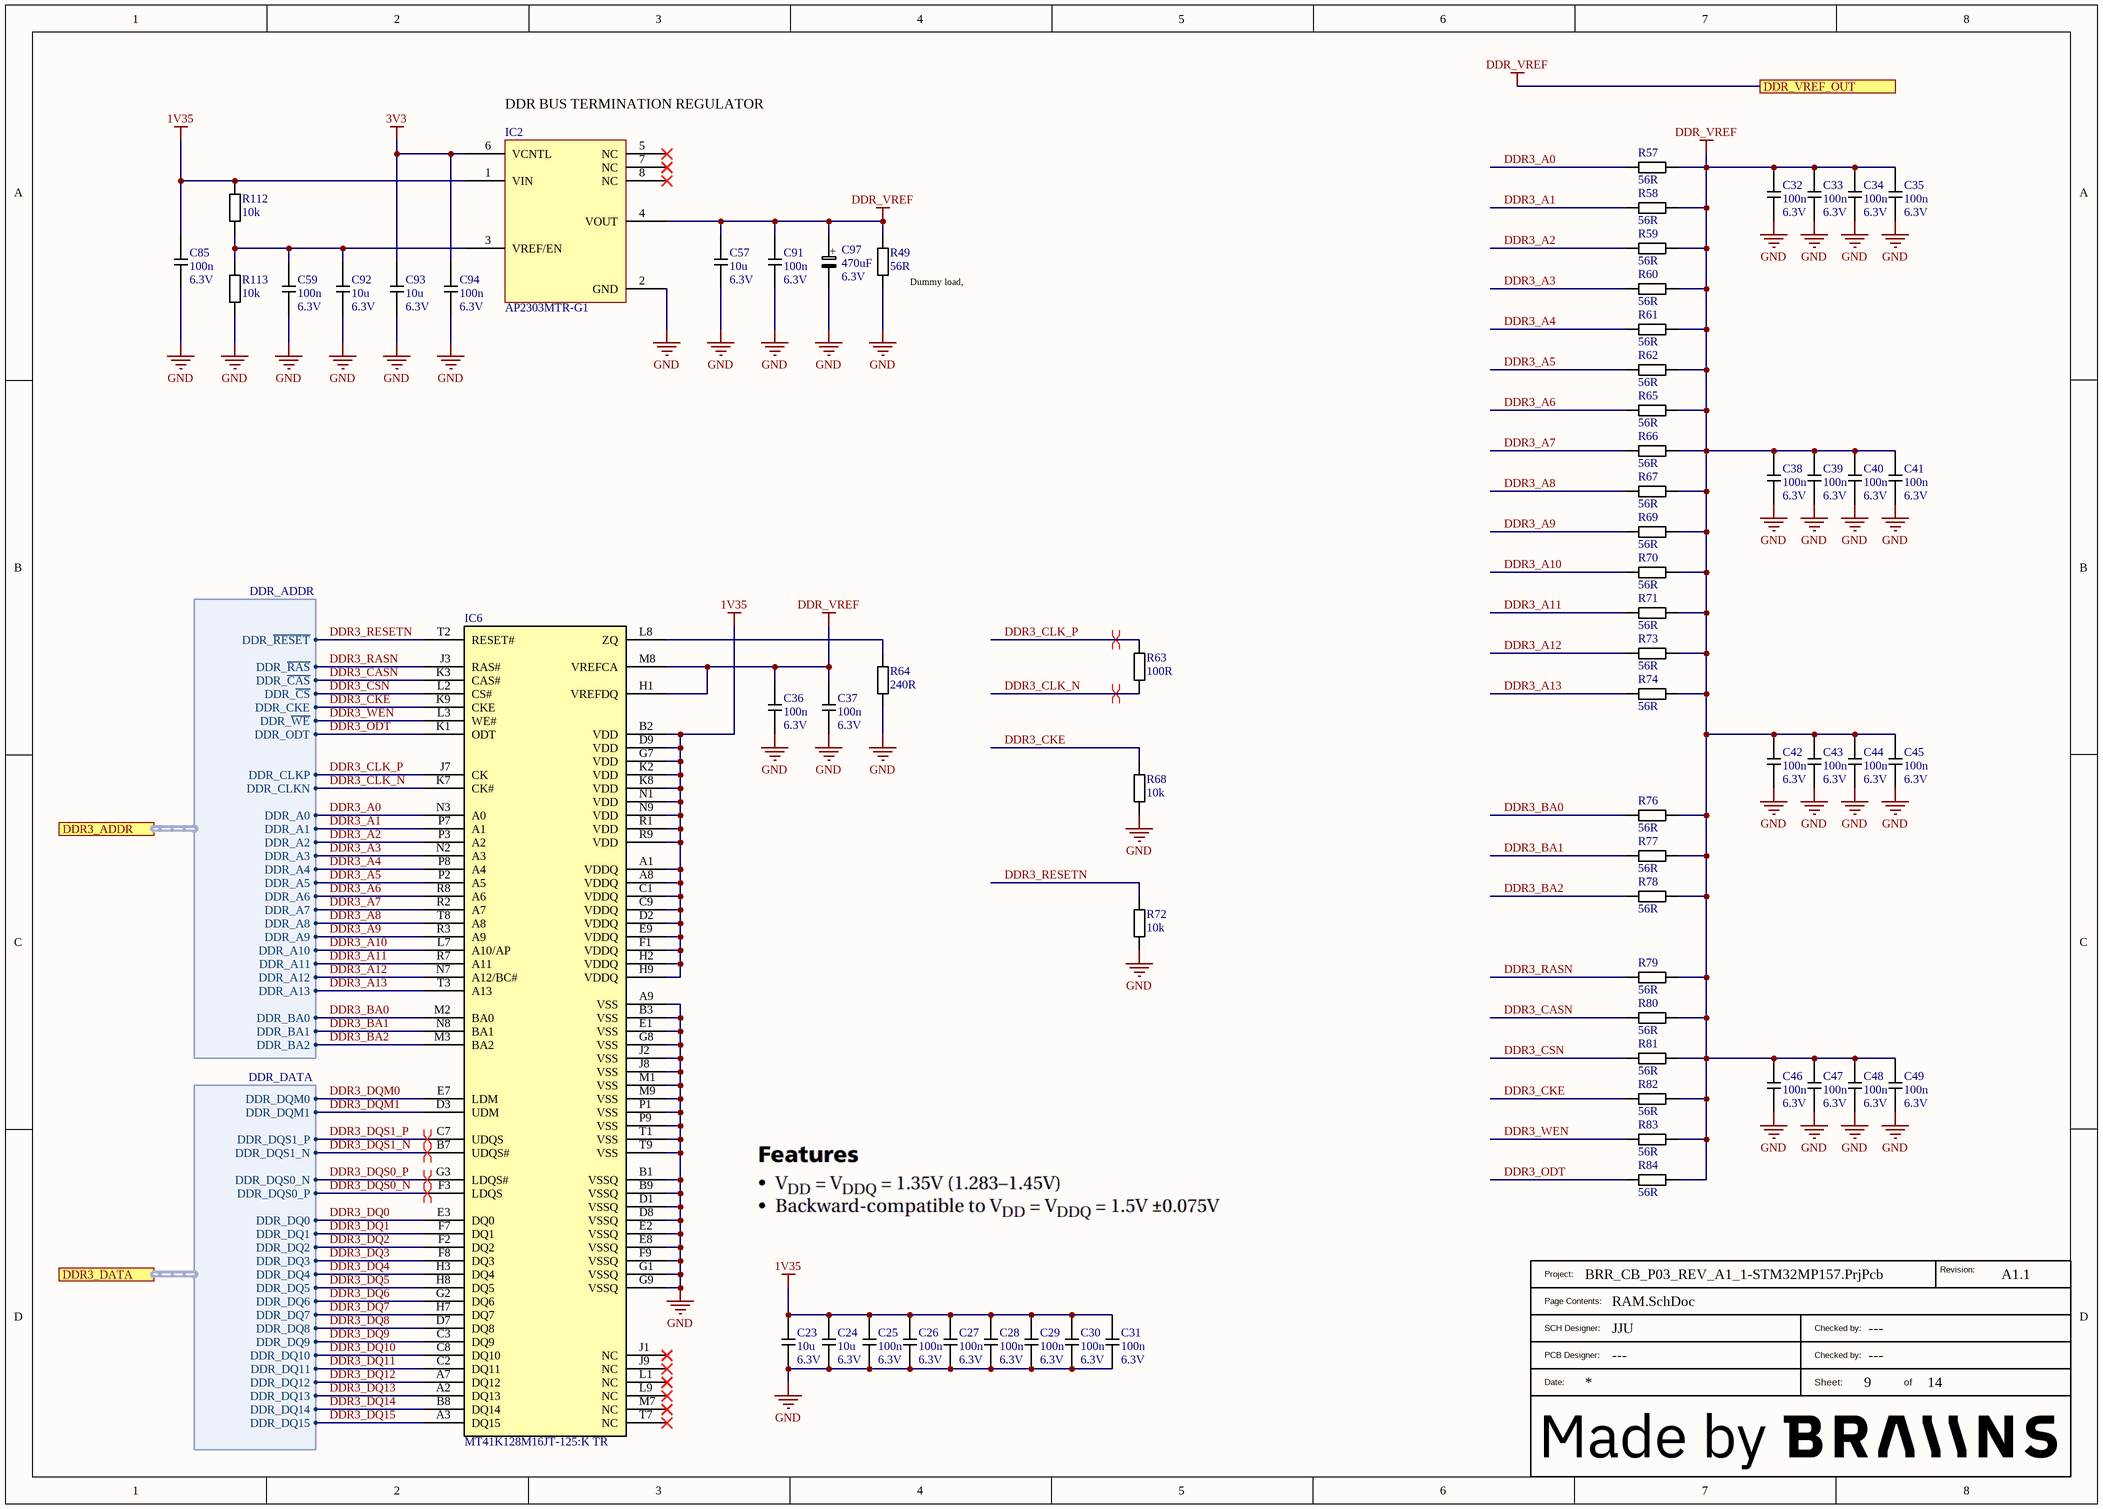
[diagram p7: RAM.SchDoc]

### Parts
(Parts that share a designator on the sheet are numbered #1, #2 ... from top to bottom, then left to right.)
?#8  BraiinsTitleBlockWithLogo  (value not drawn)  (graphical)
C23  Voltage_Rating: 6.3V  [CAP0805]  (hidden comment: 10u)
C24  Voltage_Rating: 6.3V  [CAP0805]  (hidden comment: 10u)
C25  Voltage_Rating: 6.3V  [CAP0402]  (hidden comment: 100n)
C26  Voltage_Rating: 6.3V  [CAP0402]  (hidden comment: 100n)
C27  Voltage_Rating: 6.3V  [CAP0402]  (hidden comment: 100n)
C28  Voltage_Rating: 6.3V  [CAP0402]  (hidden comment: 100n)
C29  Voltage_Rating: 6.3V  [CAP0402]  (hidden comment: 100n)
C30  Voltage_Rating: 6.3V  [CAP0402]  (hidden comment: 100n)
C31  Voltage_Rating: 6.3V  [CAP0402]  (hidden comment: 100n)
C32  Voltage_Rating: 6.3V  [CAP0402]  (hidden comment: 100n)
C33  Voltage_Rating: 6.3V  [CAP0402]  (hidden comment: 100n)
C34  Voltage_Rating: 6.3V  [CAP0402]  (hidden comment: 100n)
C35  Voltage_Rating: 6.3V  [CAP0402]  (hidden comment: 100n)
C36  Voltage_Rating: 6.3V  [CAP0402]  (hidden comment: 100n)
C37  Voltage_Rating: 6.3V  [CAP0402]  (hidden comment: 100n)
C38  Voltage_Rating: 6.3V  [CAP0402]  (hidden comment: 100n)
C39  Voltage_Rating: 6.3V  [CAP0402]  (hidden comment: 100n)
C40  Voltage_Rating: 6.3V  [CAP0402]  (hidden comment: 100n)
C41  Voltage_Rating: 6.3V  [CAP0402]  (hidden comment: 100n)
C42  Voltage_Rating: 6.3V  [CAP0402]  (hidden comment: 100n)
C43  Voltage_Rating: 6.3V  [CAP0402]  (hidden comment: 100n)
C44  Voltage_Rating: 6.3V  [CAP0402]  (hidden comment: 100n)
C45  Voltage_Rating: 6.3V  [CAP0402]  (hidden comment: 100n)
C46  Voltage_Rating: 6.3V  [CAP0402]  (hidden comment: 100n)
C47  Voltage_Rating: 6.3V  [CAP0402]  (hidden comment: 100n)
C48  Voltage_Rating: 6.3V  [CAP0402]  (hidden comment: 100n)
C49  Voltage_Rating: 6.3V  [CAP0402]  (hidden comment: 100n)
C57  Voltage_Rating: 6.3V  [CAP0603]  (hidden comment: 10u)
C59  Voltage_Rating: 6.3V  [CAP0402]  (hidden comment: 100n)
C85  Voltage_Rating: 6.3V  [CAP0402]  (hidden comment: 100n)
C91  Voltage_Rating: 6.3V  [CAP0402]  (hidden comment: 100n)
C92  Voltage_Rating: 6.3V  [CAP0603]  (hidden comment: 10u)
C93  Voltage_Rating: 6.3V  [CAP0603]  (hidden comment: 10u)
C94  Voltage_Rating: 6.3V  [CAP0402]  (hidden comment: 100n)
C97  Voltage_Rating: 6.3V  [CAP_EEEFTJ471XAP]  (hidden comment: 470uF)
IC2  AP2303MTR-G1  [SOIC8]
IC6  MT41K128M16JT-125:K TR  [BGA96C80P9X16_800X1400X120 _0.35]
R49  56R  [RES0402]
R57  56R  [RES0402]
R58  56R  [RES0402]
R59  56R  [RES0402]
R60  56R  [RES0402]
R61  56R  [RES0402]
R62  56R  [RES0402]
R63  100R  [RES0402]
R64  240R  [RES0402]
R65  56R  [RES0402]
R66  56R  [RES0402]
R67  56R  [RES0402]
R68  10k  [RES0402]
R69  56R  [RES0402]
R70  56R  [RES0402]
R71  56R  [RES0402]
R72  10k  [RES0402]
R73  56R  [RES0402]
R74  56R  [RES0402]
R76  56R  [RES0402]
R77  56R  [RES0402]
R78  56R  [RES0402]
R79  56R  [RES0402]
R80  56R  [RES0402]
R81  56R  [RES0402]
R82  56R  [RES0402]
R83  56R  [RES0402]
R84  56R  [RES0402]
R112  10k  [RES0402]
R113  10k  [RES0402]

### Ports
DDR3_ADDR (harness DDR_ADDR), DDR3_DATA (harness DDR_DATA), DDR_VREF_OUT

### Harnesses
DDR_ADDR: DDR_A0, DDR_A1, DDR_A2, DDR_A3, DDR_A4, DDR_A5, DDR_A6, DDR_A7, DDR_A8, DDR_A9, DDR_A10, DDR_A11, DDR_A12, DDR_A13, DDR_BA0, DDR_BA1, DDR_BA2, DDR_CLKP, DDR_CLKN, DDR_~{RAS}, DDR_~{CAS}, DDR_~{CS}, DDR_CKE, DDR_~{WE}, DDR_ODT, DDR_~{RESET}
DDR_DATA: DDR_DQ13, DDR_DQ9, DDR_DQ8, DDR_DQ11, DDR_DQ10, DDR_DQ15, DDR_DQ12, DDR_DQ14, DDR_DQS1_P, DDR_DQS1_N, DDR_DQ5, DDR_DQM1, DDR_DQ6, DDR_DQ2, DDR_DQ1, DDR_DQ3, DDR_DQ0, DDR_DQ4, DDR_DQ7, DDR_DQS0_P, DDR_DQS0_N, DDR_DQM0

### Nets
1V35: C23.1 C24.1 C25.1 C26.1 C27.1 C28.1 C29.1 C30.1 C31.1 C85.1 IC2.1(VIN) IC6.A1(VDDQ) IC6.A8(VDDQ) IC6.B2(VDD) IC6.C1(VDDQ) IC6.C9(VDDQ) IC6.D2(VDDQ) IC6.D9(VDD) IC6.E9(VDDQ) IC6.F1(VDDQ) IC6.G7(VDD) IC6.H2(VDDQ) IC6.H9(VDDQ) IC6.K2(VDD) IC6.K8(VDD) IC6.N1(VDD) IC6.N9(VDD) IC6.R1(VDD) IC6.R9(VDD) R112.1
3V3: C93.1 C94.1 IC2.6(VCNTL)
DDR_VREF: C32.1 C33.1 C34.1 C35.1 C36.1 C37.1 C38.1 C39.1 C40.1 C41.1 C42.1 C43.1 C44.1 C45.1 C46.1 C47.1 C48.1 C49.1 C57.1 C91.1 C97.1 IC2.4(VOUT) IC6.H1(VREFDQ) IC6.M8(VREFCA) R49.2 R57.2 R58.2 R59.2 R60.2 R61.2 R62.2 R65.2 R66.2 R67.2 R69.2 R70.2 R71.2 R73.2 R74.2 R76.2 R77.2 R78.2 R79.2 R80.2 R81.2 R82.2 R83.2 R84.2 ; port DDR_VREF_OUT
GND: C23.2 C24.2 C25.2 C26.2 C27.2 C28.2 C29.2 C30.2 C31.2 C32.2 C33.2 C34.2 C35.2 C36.2 C37.2 C38.2 C39.2 C40.2 C41.2 C42.2 C43.2 C44.2 C45.2 C46.2 C47.2 C48.2 C49.2 C57.2 C59.2 C85.2 C91.2 C92.2 C93.2 C94.2 C97.2 IC2.2(GND) IC6.A9(VSS) IC6.B1(VSSQ) IC6.B3(VSS) IC6.B9(VSSQ) IC6.D1(VSSQ) IC6.D8(VSSQ) IC6.E1(VSS) IC6.E2(VSSQ) IC6.E8(VSSQ) IC6.F9(VSSQ) IC6.G1(VSSQ) IC6.G8(VSS) IC6.G9(VSSQ) IC6.J2(VSS) IC6.J8(VSS) IC6.M1(VSS) IC6.M9(VSS) IC6.P1(VSS) IC6.P9(VSS) IC6.T1(VSS) IC6.T9(VSS) R49.1 R64.1 R68.2 R72.2 R113.2
DDR3_A0: IC6.N3(A0) R57.1 ; port DDR3_ADDR.DDR_A0
DDR3_A1: IC6.P7(A1) R58.1 ; port DDR3_ADDR.DDR_A1
DDR3_A2: IC6.P3(A2) R59.1 ; port DDR3_ADDR.DDR_A2
DDR3_A3: IC6.N2(A3) R60.1 ; port DDR3_ADDR.DDR_A3
DDR3_A4: IC6.P8(A4) R61.1 ; port DDR3_ADDR.DDR_A4
DDR3_A5: IC6.P2(A5) R62.1 ; port DDR3_ADDR.DDR_A5
DDR3_A6: IC6.R8(A6) R65.1 ; port DDR3_ADDR.DDR_A6
DDR3_A7: IC6.R2(A7) R66.1 ; port DDR3_ADDR.DDR_A7
DDR3_A8: IC6.T8(A8) R67.1 ; port DDR3_ADDR.DDR_A8
DDR3_A9: IC6.R3(A9) R69.1 ; port DDR3_ADDR.DDR_A9
DDR3_A10: IC6.L7(A10/AP) R70.1 ; port DDR3_ADDR.DDR_A10
DDR3_A11: IC6.R7(A11) R71.1 ; port DDR3_ADDR.DDR_A11
DDR3_A12: IC6.N7(A12/BC#) R73.1 ; port DDR3_ADDR.DDR_A12
DDR3_A13: IC6.T3(A13) R74.1 ; port DDR3_ADDR.DDR_A13
DDR3_BA0: IC6.M2(BA0) R76.1 ; port DDR3_ADDR.DDR_BA0
DDR3_BA1: IC6.N8(BA1) R77.1 ; port DDR3_ADDR.DDR_BA1
DDR3_BA2: IC6.M3(BA2) R78.1 ; port DDR3_ADDR.DDR_BA2
DDR3_CASN: IC6.K3(CAS#) R80.1 ; port DDR3_ADDR.DDR_~{CAS}
DDR3_CKE: IC6.K9(CKE) R68.1 R82.1 ; port DDR3_ADDR.DDR_CKE
DDR3_CLK_N: IC6.K7(CK#) R63.2 ; port DDR3_ADDR.DDR_CLKN
DDR3_CLK_P: IC6.J7(CK) R63.1 ; port DDR3_ADDR.DDR_CLKP
DDR3_CSN: IC6.L2(CS#) R81.1 ; port DDR3_ADDR.DDR_~{CS}
DDR3_DQ0: IC6.E3(DQ0) ; port DDR3_DATA.DDR_DQ0
DDR3_DQ1: IC6.F7(DQ1) ; port DDR3_DATA.DDR_DQ1
DDR3_DQ2: IC6.F2(DQ2) ; port DDR3_DATA.DDR_DQ2
DDR3_DQ3: IC6.F8(DQ3) ; port DDR3_DATA.DDR_DQ3
DDR3_DQ4: IC6.H3(DQ4) ; port DDR3_DATA.DDR_DQ4
DDR3_DQ5: IC6.H8(DQ5) ; port DDR3_DATA.DDR_DQ5
DDR3_DQ6: IC6.G2(DQ6) ; port DDR3_DATA.DDR_DQ6
DDR3_DQ7: IC6.H7(DQ7) ; port DDR3_DATA.DDR_DQ7
DDR3_DQ8: IC6.D7(DQ8) ; port DDR3_DATA.DDR_DQ8
DDR3_DQ9: IC6.C3(DQ9) ; port DDR3_DATA.DDR_DQ9
DDR3_DQ10: IC6.C8(DQ10) ; port DDR3_DATA.DDR_DQ10
DDR3_DQ11: IC6.C2(DQ11) ; port DDR3_DATA.DDR_DQ11
DDR3_DQ12: IC6.A7(DQ12) ; port DDR3_DATA.DDR_DQ12
DDR3_DQ13: IC6.A2(DQ13) ; port DDR3_DATA.DDR_DQ13
DDR3_DQ14: IC6.B8(DQ14) ; port DDR3_DATA.DDR_DQ14
DDR3_DQ15: IC6.A3(DQ15) ; port DDR3_DATA.DDR_DQ15
DDR3_DQM0: IC6.E7(LDM) ; port DDR3_DATA.DDR_DQM0
DDR3_DQM1: IC6.D3(UDM) ; port DDR3_DATA.DDR_DQM1
DDR3_DQS0_N: IC6.F3(LDQS) ; port DDR3_DATA.DDR_DQS0_P
DDR3_DQS0_P: IC6.G3(LDQS#) ; port DDR3_DATA.DDR_DQS0_N
DDR3_DQS1_N: IC6.B7(UDQS#) ; port DDR3_DATA.DDR_DQS1_N
DDR3_DQS1_P: IC6.C7(UDQS) ; port DDR3_DATA.DDR_DQS1_P
DDR3_ODT: IC6.K1(ODT) R84.1 ; port DDR3_ADDR.DDR_ODT
DDR3_RASN: IC6.J3(RAS#) R79.1 ; port DDR3_ADDR.DDR_~{RAS}
DDR3_RESETN: IC6.T2(RESET#) R72.1 ; port DDR3_ADDR.DDR_~{RESET}
DDR3_WEN: IC6.L3(WE#) R83.1 ; port DDR3_ADDR.DDR_~{WE}
NetC59_1: C59.1 C92.1 IC2.3(VREF/EN) R112.2 R113.1
NetIC6_L8: IC6.L8(ZQ) R64.2

Not connected (* = marked no-connect by the designer): IC2 5(NC)* 7(NC)* 8(NC)*; IC6 J1(NC)* J9(NC)* L1(NC)* L9(NC)* M7(NC)* T7(NC)*

### Layout directives
differential pair: DDR3_CLK_N, DDR3_CLK_P, DDR3_DQS0_N, DDR3_DQS0_P, DDR3_DQS1_N, DDR3_DQS1_P

### Notes on the sheet
- (near IC2) DDR BUS TERMINATION REGULATOR
- (near R49) Dummy load,
- (in symbol 30239) +
- (in symbol BraiinsTitleBlockWithLogo) Revision:; Project:; Page Contents:; SCH Designer:; Checked by:; PCB Designer:; Date:; Sheet:; of

### Library data of the parts
C23 C24 = 30174: as C15 on sheet PowerSupply; Value: 10u; Sub_Type: CER; Manufacturer Part Description: CAP CER 10u 10% 6.3V X7R 0805; Package_Case: 0805; Dielectric: X7R; Tolerance: 10%; Created By: janjuranek; Created_Date: 2023-05-09 02:18:46; Updated_Date: 2023-05-09 02:19:22; ComponentLink1Description: Datasheet; ComponentLink2Description: Supplier Part Details; RoHS: Yes
C25-C49 C59 C85 C91 C94 = 30154: as C16 on sheet PowerSupply; Value: 100n; Sub_Type: CER; Manufacturer Part Description: CAP CER 100n 10% 6.3V 0402; Package_Case: 0402; RoHS: Yes; Tolerance: 10%; Created By: janjuranek; Created_Date: 2023-05-01 19:17:49; Updated_Date: 2023-05-01 19:19:14; ComponentLink1Description: Datasheet; ComponentLink2Description: Supplier Part Details
C57 C92 C93 = 30139: CAP CER 10u 10% 6.3V 0603 X5R; Part_Type: Capacitor; Part_Status: New; ID: 30139; Updated By: janjuranek; Sorted_Value: 10; Value: 10u; Sub_Type: CER; Manufacturer Part Description: CAP CER 10u 10% 6.3V 0603 X5R; Package_Case: 0603; RoHS: Yes; Dielectric: X5R; Tolerance: 10%; Created By: janjuranek; Created_Date: 2023-04-12 21:40:22; Updated_Date: 2023-04-12 21:42:06; ComponentLink1Description: Datasheet; ComponentLink2Description: Supplier Part Details
C97 = 30239: as C86 on sheet PowerSupply; Value: 470uF; Manufacturer Part Description: CAP ELECT 470uF ±20% 6.3V Radial, Can - SMD; Supplier 1: Digi-Key; Supplier Part Number 1: P15096TR-ND; Package_Case: Radial, Can - SMD; RoHS: Yes; Temperature Range: -55C to +105C; Tolerance: ±20%; Created By: janjuranek; Created_Date: 2023-10-13 11:39:12; Updated_Date: 2023-10-13 11:39:46; ComponentLink1Description: Datasheet; ComponentLink2Description: Supplier Part Details; ComponentLink2URL: https://www.digikey.com/products/en?keywords=EEE-FTJ471XAP
IC2 = 30185: IC REG CONV DDR 1OUT 8SOIC; Manufacturer: Diodes Incorporated; Part_Status: New; ID: 30185; Updated By: janjuranek; Value: AP2303MTR-G1; Part_Type: IC; Manufacturer Part Number: AP2303MTR-G1; Manufacturer Part Description: IC REG CONV DDR 1OUT 8SOIC; Supplier 1: Digi-Key; Supplier Part Number 1: AP2303MTR-G1DITR-ND; Package_Case: SOIC8; RoHS: Yes; Temperature Range: -40C to +85C; Created By: janjuranek; Created_Date: 2023-05-23 03:56:05; Updated_Date: 2023-05-23 04:00:42; ComponentLink1Description: Datasheet; ComponentLink2Description: Supplier Part Details; ComponentLink2URL: https://www.digikey.com/products/en?keywords=AP2303MTR-G1
IC6 = 30135: IC DRAM 2GBIT PARALLEL 96FBGA; Manufacturer: Micron Technology Inc.; Part_Status: New; ID: 30135; Updated By: janjuranek; Value: MT41K128M16JT-125:K TR; Part_Type: IC; Manufacturer Part Number: MT41K128M16JT-125:K TR; Manufacturer Part Description: IC DRAM 2GBIT PARALLEL 96FBGA; Supplier 1: Digi-Key; Supplier Part Number 1: MT41K128M16JT-125:KTR-ND; Package_Case: 96-TFBGA; RoHS: Yes; Temperature Range: 0C to +95C (TC); Created By: janjuranek; Created_Date: 2023-04-11 10:23:31; Updated_Date: 2023-05-04 17:49:41; ComponentLink1Description: Datasheet; ComponentLink2Description: Supplier Part Details; ComponentLink2URL: https://www.digikey.com/products/en?keywords=MT41K128M16JT-125:K TR
R49 R57-R62 R65-R67 R69-R71 R73 R74 R76-R84 = 30143: RES 56R Ohm 1% 0402; Part_Status: New; ID: 30143; Updated By: janjuranek; Sorted_Value: 56; Value: 56R; Part_Type: Resistor; Manufacturer Part Description: RES 56R Ohm 1% 0402; Package_Case: 0402; RoHS: Yes; Tolerance: 1%; Created By: janjuranek; Created_Date: 2023-04-13 01:07:23; Updated_Date: 2023-04-13 01:07:42; ComponentLink1Description: Datasheet; ComponentLink2Description: Supplier Part Details
R63 = 30142: RES 100R Ohm 1% 0402; Part_Status: New; ID: 30142; Updated By: janjuranek; Sorted_Value: 100; Value: 100R; Part_Type: Resistor; Manufacturer Part Description: RES 100R Ohm 1% 0402; Package_Case: 0402; RoHS: Yes; Tolerance: 1%; Created By: janjuranek; Created_Date: 2023-04-13 00:40:40; Updated_Date: 2023-04-13 00:41:13; ComponentLink1Description: Datasheet; ComponentLink2Description: Supplier Part Details
R64 = 30141: RES 240R Ohm 1% 0402; Part_Status: New; ID: 30141; Updated By: janjuranek; Sorted_Value: 240; Value: 240R; Part_Type: Resistor; Manufacturer Part Description: RES 240R Ohm 1% 0402; Package_Case: 0402; RoHS: Yes; Tolerance: 1%; Created By: janjuranek; Created_Date: 2023-04-13 00:40:15; Updated_Date: 2023-04-13 00:40:34; ComponentLink1Description: Datasheet; ComponentLink2Description: Supplier Part Details
R68 R72 = 30071: as R97 on sheet PowerSupply; Value: 10k; Part_Type: Resistor; Manufacturer Part Description: RES 10k Ohm 1% 0402; Package_Case: 0402; RoHS: Yes; Temperature Range: -40 to +150C; Tolerance: 1%; Created By: Jan; Created_Date: 2023-03-02 13:13:56; Updated_Date: 2023-03-02 13:14:31; ComponentLink1Description: Datasheet; ComponentLink2Description: Supplier Part Details
R112 R113 = 30177: RES 10k Ohm 0.1% 0402; Part_Status: New; ID: 30177; Updated By: janjuranek; Sorted_Value: 10000; Value: 10k; Part_Type: Resistor; Manufacturer Part Description: RES 10k Ohm 0.1% 0402; Package_Case: 0402; RoHS: Yes; Tolerance: 0.1%; Created By: janjuranek; Created_Date: 2023-05-09 11:07:54; Updated_Date: 2023-05-09 11:08:21; ComponentLink1Description: Datasheet; ComponentLink2Description: Supplier Part Details

## Sheet HBInterface.SchDoc
size A4; SheetNumber: 10; SheetTotal: 14
Used 4 times, as channels U_HBInterface_0, U_HBInterface_1, U_HBInterface_2, U_HBInterface_3. Parts and nets are listed once, with the designators drawn on the sheet.
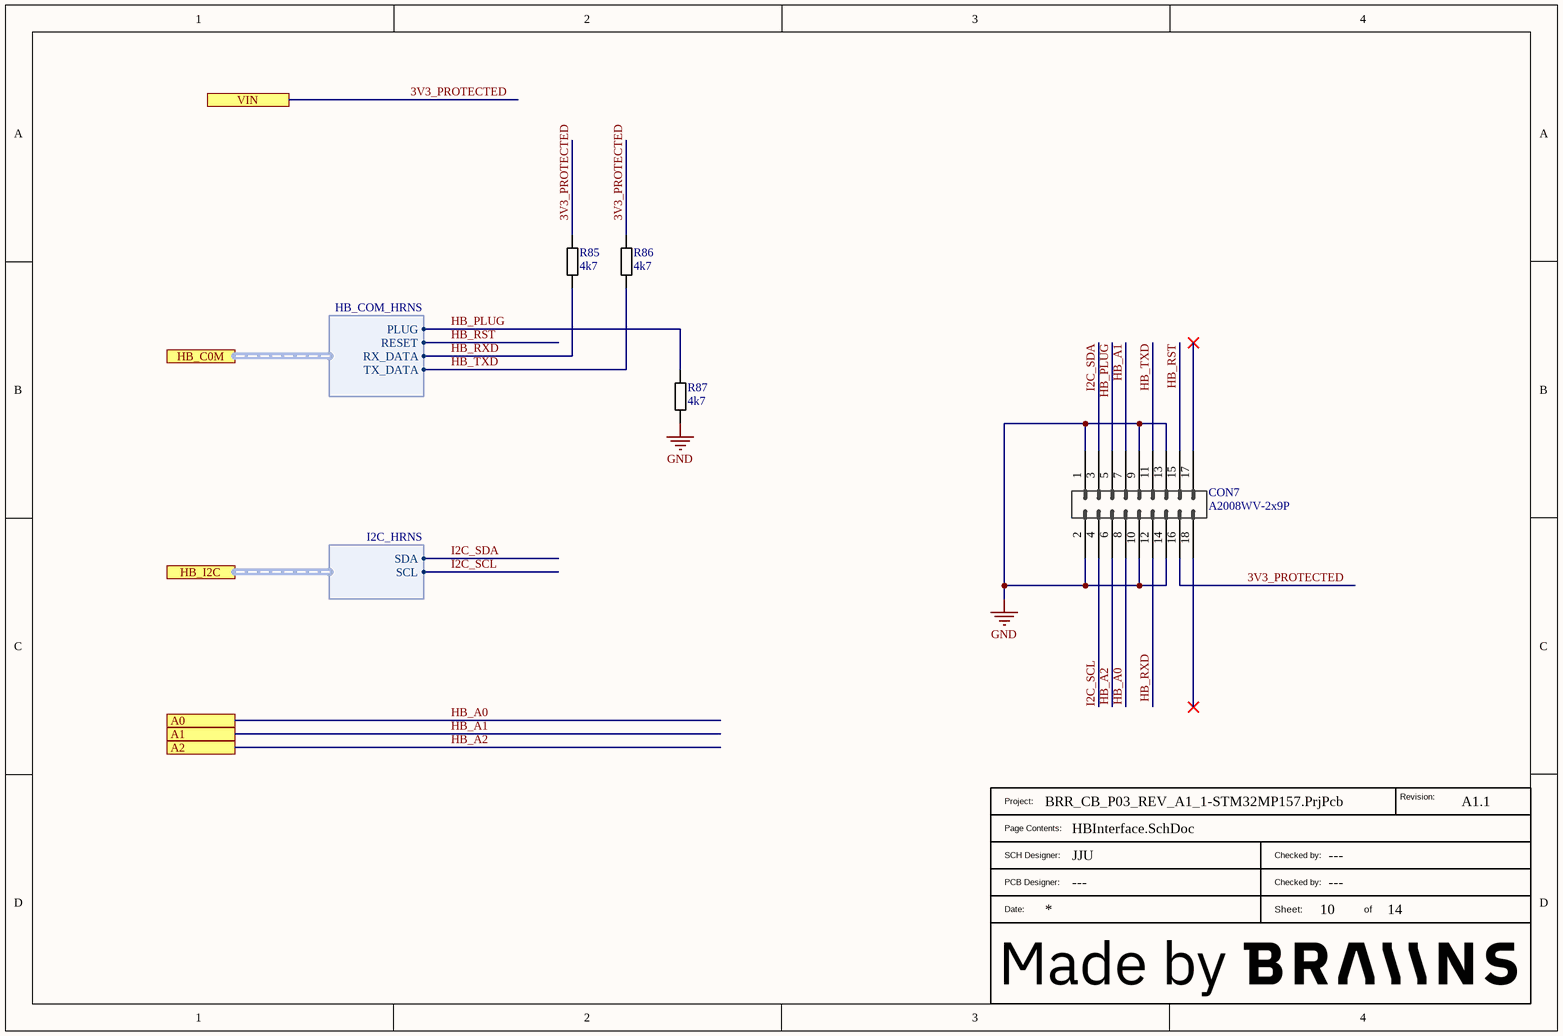
[diagram p8: HBInterface.SchDoc]

### Parts
?  BraiinsTitleBlockWithLogo  (value not drawn)  (graphical)
CON7  A2008WV-2x9P  [A2008WV-2X9P]
R85  4k7  [RES0402]
R86  4k7  [RES0402]
R87  4k7  [RES0402]

### Ports
A0, A1, A2, HB_C0M (harness HB_COM_HRNS), HB_I2C (harness I2C_HRNS), VIN

### Harnesses
HB_COM_HRNS: PLUG, RESET, RX_DATA, TX_DATA
I2C_HRNS: SDA, SCL

### Nets
GND: CON7.1 CON7.2 CON7.9 CON7.10 CON7.13 CON7.14 R87.2
3V3_PROTECTED: CON7.16 R85.1 R86.1 ; port VIN
HB_A0: CON7.8 ; port A0
HB_A1: CON7.7 ; port A1
HB_A2: CON7.6 ; port A2
HB_PLUG: CON7.5 R87.1 ; port HB_C0M.PLUG
HB_RST: CON7.15 ; port HB_C0M.RESET
HB_RXD: CON7.12 R85.2 ; port HB_C0M.RX_DATA
HB_TXD: CON7.11 R86.2 ; port HB_C0M.TX_DATA
I2C_SCL: CON7.4 ; port HB_I2C.SCL
I2C_SDA: CON7.3 ; port HB_I2C.SDA

Not connected (* = marked no-connect by the designer): CON7 17* 18*

### Channels
U_HBInterface_0: designators ?=?A#1 CON7=CON7A R85=R85A R86=R86A R87=R87A; ports A0=GND A1=GND A2=GND VIN=3V3_PROTECTED
U_HBInterface_1: designators ?=?B#1 CON7=CON7B R85=R85B R86=R86B R87=R87B; ports A0=3V3_PROTECTED A1=GND A2=GND VIN=3V3_PROTECTED
U_HBInterface_2: designators ?=?C#1 CON7=CON7C R85=R85C R86=R86C R87=R87C; ports A0=GND A1=3V3_PROTECTED A2=GND VIN=3V3_PROTECTED
U_HBInterface_3: designators ?=?D#1 CON7=CON7D R85=R85D R86=R86D R87=R87D; ports A0=3V3_PROTECTED A1=3V3_PROTECTED A2=GND VIN=3V3_PROTECTED

### Notes on the sheet
- (in symbol BraiinsTitleBlockWithLogo) Revision:; Project:; Page Contents:; SCH Designer:; Checked by:; PCB Designer:; Date:; Sheet:; of

### Library data of the parts
CON7 = 30124: Connector THT, vertical, 2mm pitch; Manufacturer: CJT; Part_Status: New; ID: 30124; Updated By: janjuranek; Value: A2008WV-2x9P; Part_Type: Connector; Manufacturer Part Number: A2008WV-2x9P; Manufacturer Part Description: Connector THT, vertical, 2mm pitch; RoHS: Yes; Created By: janjuranek; Created_Date: 2023-03-23 13:37:15; Updated_Date: 2023-03-23 13:39:21; ComponentLink1Description: Datasheet; ComponentLink2Description: Supplier Part Details
R85-R87 = 30073: RES 4k7 Ohm 1% 0402; Part_Status: New; ID: 30073; Updated By: Jan; Sorted_Value: 4; Value: 4k7; Part_Type: Resistor; Manufacturer Part Description: RES 4k7 Ohm 1% 0402; Package_Case: 0402; RoHS: Yes; Temperature Range: -40 to +150C; Tolerance: 1%; Created By: Jan; Created_Date: 2023-03-02 13:15:12; Updated_Date: 2023-03-02 13:15:46; ComponentLink1Description: Datasheet; ComponentLink2Description: Supplier Part Details

## Sheet Debug.SchDoc
size A4; SheetNumber: 3; SheetTotal: 14
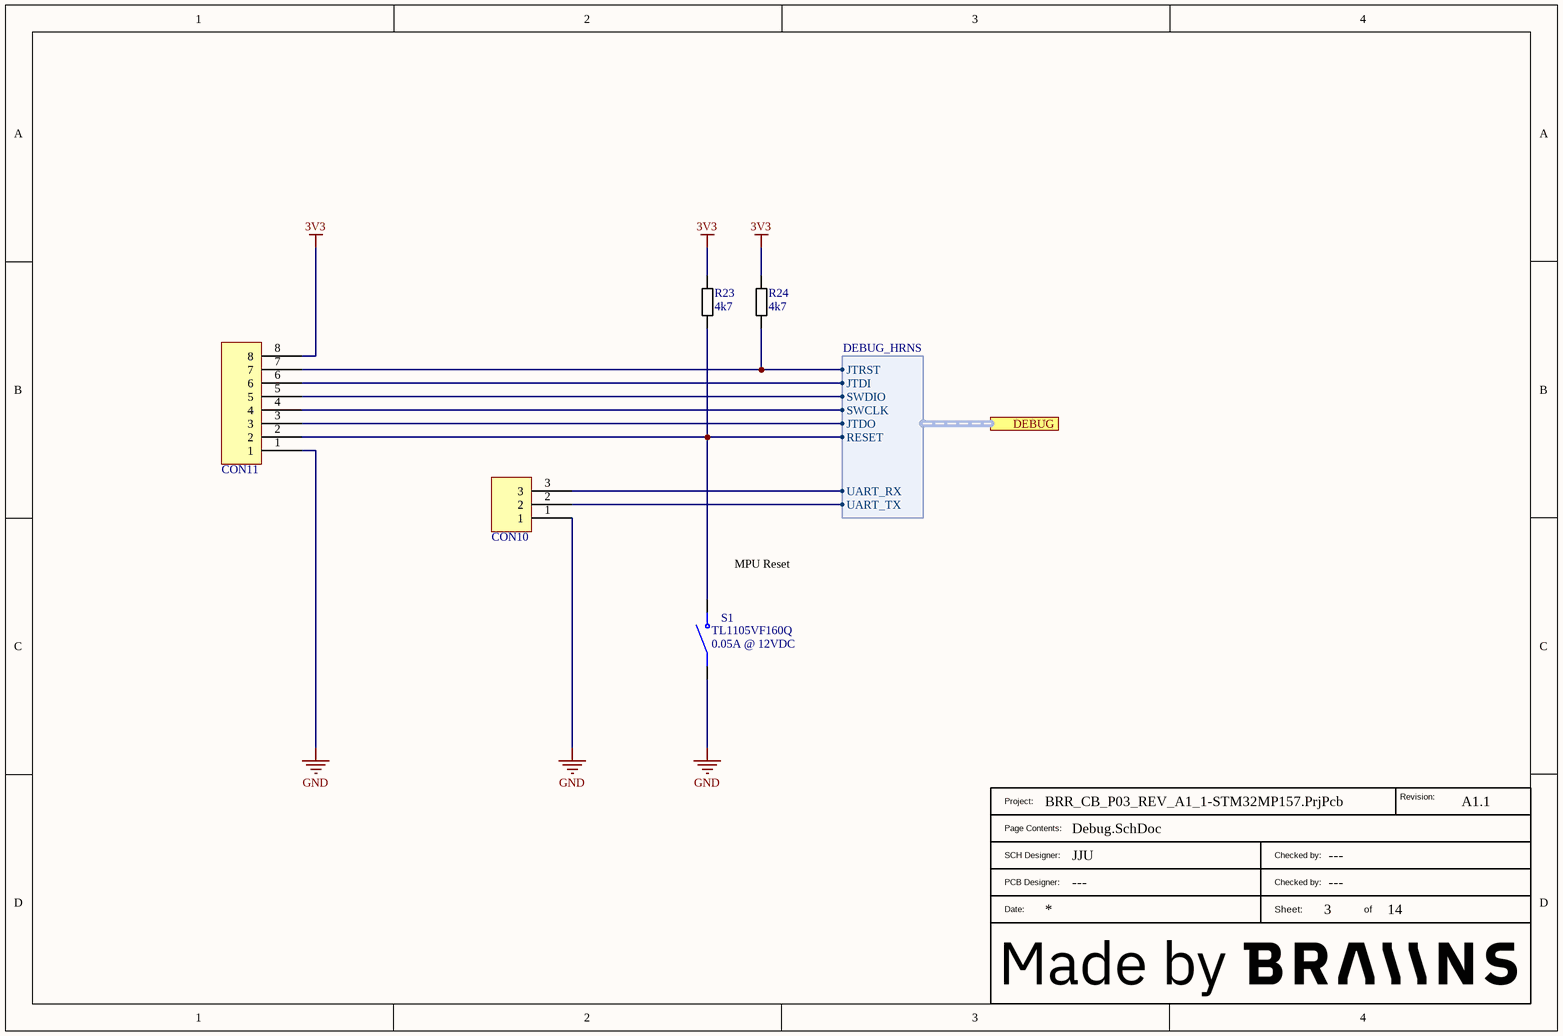
[diagram p9: Debug.SchDoc]

### Parts
(Parts that share a designator on the sheet are numbered #1, #2 ... from top to bottom, then left to right.)
?#9  BraiinsTitleBlockWithLogo  (value not drawn)  (graphical)
CON10  Connector 3pin  [PIN_HEADER_254_3]  (value not drawn)
CON11  Connector 8pin  [PIN_HEADER_254_2x4]  (value not drawn)
R23  4k7  [RES0402]
R24  4k7  [RES0402]
S1  Voltage_Rating: 0.05A @ 12VDC  [SW_TL1105VF160Q]  (hidden comment: TL1105VF160Q)

### Ports
DEBUG (harness DEBUG_HRNS)

### Harnesses
DEBUG_HRNS: JTDI, JTDO, JTRST, RESET, SWCLK, SWDIO, UART_RX, UART_TX

### Nets
3V3: CON11.8 R23.1 R24.1
GND: CON10.1 CON11.1 S1.1
UART4_RX: CON10.3 ; port DEBUG.UART_RX
UART4_TX: CON10.2 ; port DEBUG.UART_TX
NetC89_2: CON11.2 R23.2 S1.2 ; port DEBUG.RESET
NetCON11_3: CON11.3 ; port DEBUG.JTDO
NetCON11_4: CON11.4 ; port DEBUG.SWCLK
NetCON11_5: CON11.5 ; port DEBUG.SWDIO
NetCON11_6: CON11.6 ; port DEBUG.JTDI
NetCON11_7: CON11.7 R24.2 ; port DEBUG.JTRST

### Notes on the sheet
- (near S1) MPU Reset
- (in symbol BraiinsTitleBlockWithLogo) Revision:; Project:; Page Contents:; SCH Designer:; Checked by:; PCB Designer:; Date:; Sheet:; of

### Library data of the parts
CON10 = 30103: Pin Header 1x3, 2.54mm; Part_Status: New; ID: 30103; Updated By: janjuranek; Part_Type: Connector; Manufacturer Part Description: Pin Header 1x3, 2.54mm; RoHS: Yes; Created By: janjuranek; Created_Date: 2023-03-14 02:43:17; Updated_Date: 2023-03-14 02:43:55; ComponentLink1Description: Datasheet; ComponentLink2Description: Supplier Part Details
CON11 = 30181: Pin Header 2x4 2.54mm; Part_Status: New; ID: 30181; Updated By: janjuranek; Part_Type: Connector; Manufacturer Part Description: Pin Header 2x4 2.54mm; Package_Case: THT; RoHS: Yes; Created By: janjuranek; Created_Date: 2023-05-15 18:44:13; Updated_Date: 2023-05-15 18:44:54; ComponentLink1Description: Datasheet; ComponentLink2Description: Supplier Part Details
R23 R24 = 30073: as R85-R87 on sheet HBInterface; Value: 4k7; Part_Type: Resistor; Manufacturer Part Description: RES 4k7 Ohm 1% 0402; Package_Case: 0402; RoHS: Yes; Tolerance: 1%; Created By: Jan; Created_Date: 2023-03-02 13:15:12; Updated_Date: 2023-03-02 13:15:46; ComponentLink1Description: Datasheet; ComponentLink2Description: Supplier Part Details; Temperature Range: -40 to +150C
S1 = 30149: SWITCH TACTILE SPST-NO 0.05A 12V; Manufacturer: E-Switch; Part_Status: New; ID: 30149; Updated By: janjuranek; Value: TL1105VF160Q; Part_Type: Switch; Manufacturer Part Number: TL1105VF160Q; Manufacturer Part Description: SWITCH TACTILE SPST-NO 0.05A 12V; Supplier 1: Digi-Key; Supplier Part Number 1: EG2508-ND; RoHS: Yes; Temperature Range: -20C to +70C; Created By: janjuranek; Created_Date: 2023-04-27 16:07:58; Updated_Date: 2023-04-27 17:09:30; ComponentLink1Description: Datasheet; ComponentLink2Description: Supplier Part Details; ComponentLink2URL: https://www.digikey.com/products/en?keywords=TL1105VF160Q

## Sheet UserInterface.SchDoc
size A4; SheetNumber: 11; SheetTotal: 14
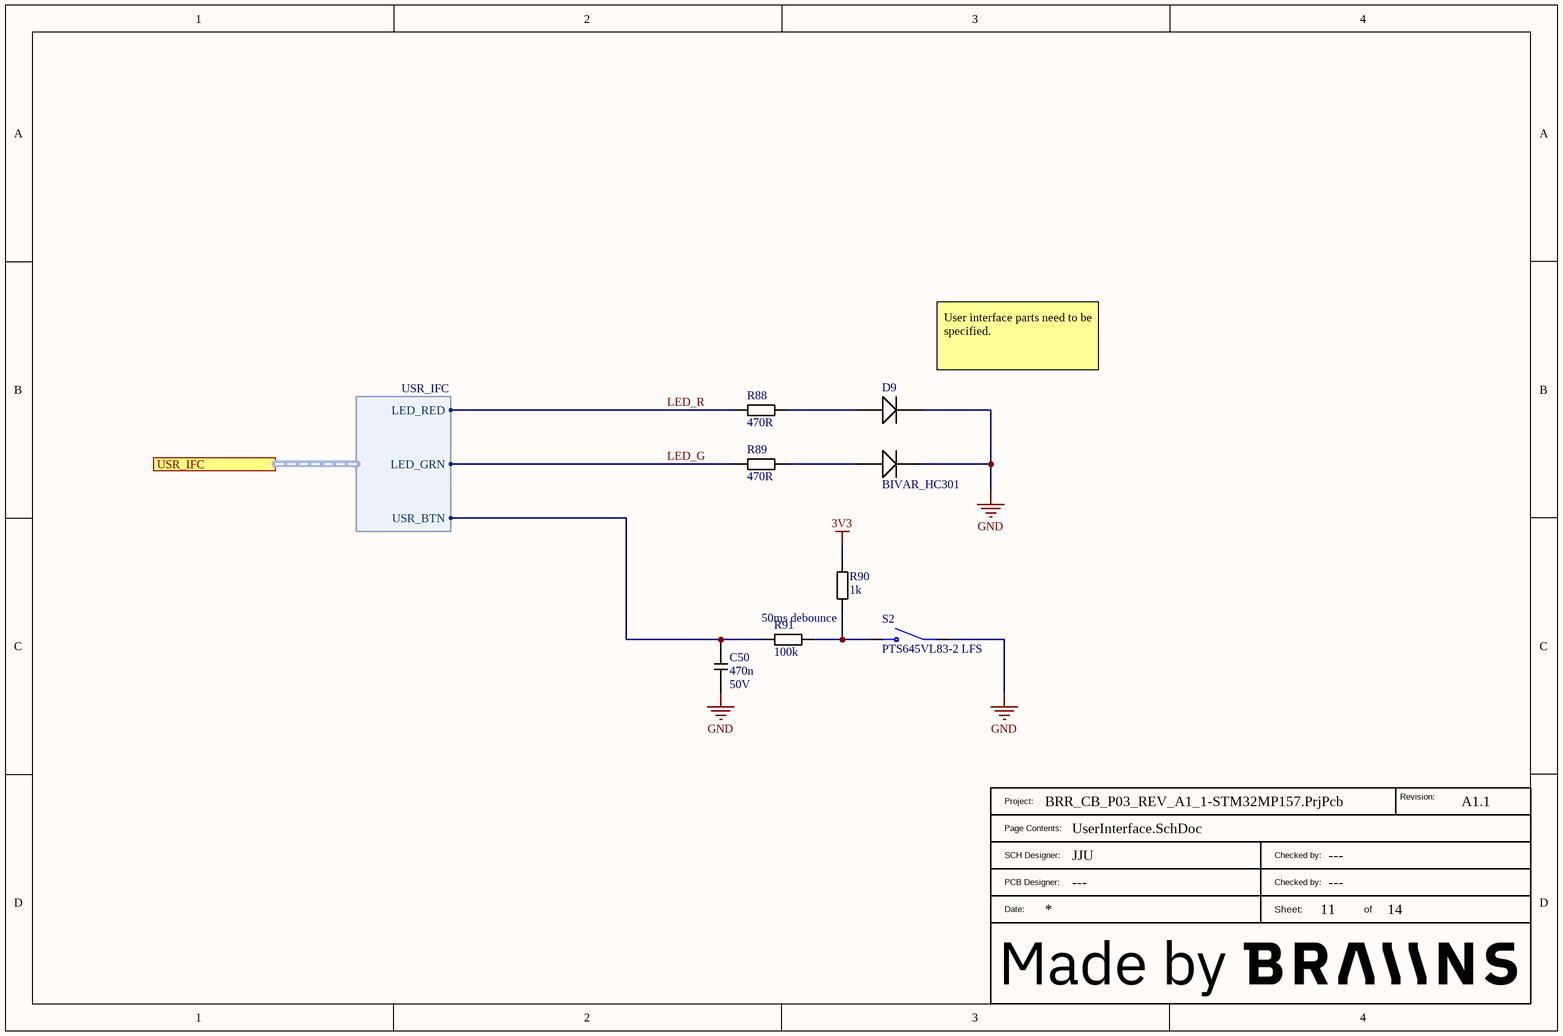
[diagram p10: UserInterface.SchDoc]

### Parts
(Parts that share a designator on the sheet are numbered #1, #2 ... from top to bottom, then left to right.)
?#10  BraiinsTitleBlockWithLogo  (value not drawn)  (graphical)
C50  Voltage_Rating: 50V  [CAP0603]  (hidden comment: 470n)
D9  BIVAR_HC301  [BIVAR_HC301]
R88  470R  [RES0402]
R89  470R  [RES0402]
R90  1k  [RES0402]
R91  100k  [RES0402]
S2  PTS645VL83-2 LFS  [THT_TACTILE_75x45_8mm35]

### Ports
USR_IFC (harness USR_IFC)

### Harnesses
USR_IFC: LED_RED, LED_GRN, USR_BTN

### Nets
3V3: R90.2
GND: C50.2 D9.2(C) D9.4(C) S2.1
LED_G: R89.1 ; port USR_IFC.LED_GRN
LED_R: R88.1 ; port USR_IFC.LED_RED
USER_BUTTON: C50.1 R91.2 ; port USR_IFC.USR_BTN
NetD9_1: D9.1(A) R88.2
NetD9_3: D9.3(A) R89.2
NetR90_1: R90.1 R91.1 S2.2

### Notes on the sheet
- User interface parts need to be specified.
- 50ms debounce
- (in symbol BraiinsTitleBlockWithLogo) Revision:; Project:; Page Contents:; SCH Designer:; Checked by:; PCB Designer:; Date:; Sheet:; of

### Library data of the parts
C50 = 30133: CAP CER 470n 10% 50V 0603; Part_Type: Capacitor; Part_Status: New; ID: 30133; Updated By: janjuranek; Sorted_Value: 470; Value: 470n; Sub_Type: CER; Manufacturer Part Description: CAP CER 470n 10% 50V 0603; Package_Case: 0603; RoHS: Yes; Tolerance: 10%; Created By: janjuranek; Created_Date: 2023-04-04 16:57:09; Updated_Date: 2023-04-04 16:57:39; ComponentLink1Description: Datasheet; ComponentLink2Description: Supplier Part Details
D9 = 30151: DUAL LED TERMINAL; Manufacturer: BIVAR; Part_Status: New; ID: 30151; Updated By: janjuranek; Notes: probably not right footprint.; Value: BIVAR_HC301; Manufacturer Part Number: BIVAR_HC301; Manufacturer Part Description: DUAL LED TERMINAL; Created By: janjuranek; Created_Date: 2023-04-27 16:22:05; Updated_Date: 2023-04-27 16:22:48; ComponentLink1Description: Datasheet; ComponentLink2Description: Supplier Part Details
R88 R89 = 30084: RES 470R Ohm 1% 0402; Part_Status: New; ID: 30084; Updated By: Jan; Sorted_Value: 470; Value: 470R; Part_Type: Resistor; Manufacturer Part Description: RES 470R Ohm 1% 0402; Package_Case: 0402; RoHS: Yes; Tolerance: 1%; Created By: Jan; Created_Date: 2023-03-02 16:05:04; Updated_Date: 2023-03-02 16:05:22; ComponentLink1Description: Datasheet; ComponentLink2Description: Supplier Part Details
R90 = 30070: RES 1k Ohm 1% 0402; Part_Status: New; ID: 30070; Updated By: Jan; Sorted_Value: 1000; Value: 1k; Part_Type: Resistor; Manufacturer Part Description: RES 1k Ohm 1% 0402; Package_Case: 0402; RoHS: Yes; Tolerance: 1%; Created By: Jan; Created_Date: 2023-03-02 13:13:07; Updated_Date: 2023-03-02 13:13:47; ComponentLink1Description: Datasheet; ComponentLink2Description: Supplier Part Details; Temperature Range: -40 to +150C
R91 = 30079: RES 100k Ohm 1% 0402; Part_Status: New; ID: 30079; Updated By: Jan; Sorted_Value: 100000; Value: 100k; Part_Type: Resistor; Manufacturer Part Description: RES 100k Ohm 1% 0402; Package_Case: 0402; RoHS: Yes; Tolerance: 1%; Created By: Jan; Created_Date: 2023-03-02 15:13:26; Updated_Date: 2023-03-02 15:13:51; ComponentLink1Description: Datasheet; ComponentLink2Description: Supplier Part Details
S2 = 30182: SWITCH TACTILE SPST-NO 0.05A 12V, LEVER 8.35mm; Part_Status: New; ID: 30182; Updated By: janjuranek; Value: PTS645VL83-2 LFS; Part_Type: Switch; Manufacturer Part Number: PTS645VL83-2 LFS; Manufacturer Part Description: SWITCH TACTILE SPST-NO 0.05A 12V, LEVER 8.35mm; RoHS: Yes; Created By: janjuranek; Created_Date: 2023-05-17 17:51:23; Updated_Date: 2023-05-17 17:53:09; ComponentLink1Description: Datasheet; ComponentLink2Description: Supplier Part Details

## Sheet PowerSupplyInterface.SchDoc
size A4; SheetNumber: 12; SheetTotal: 14
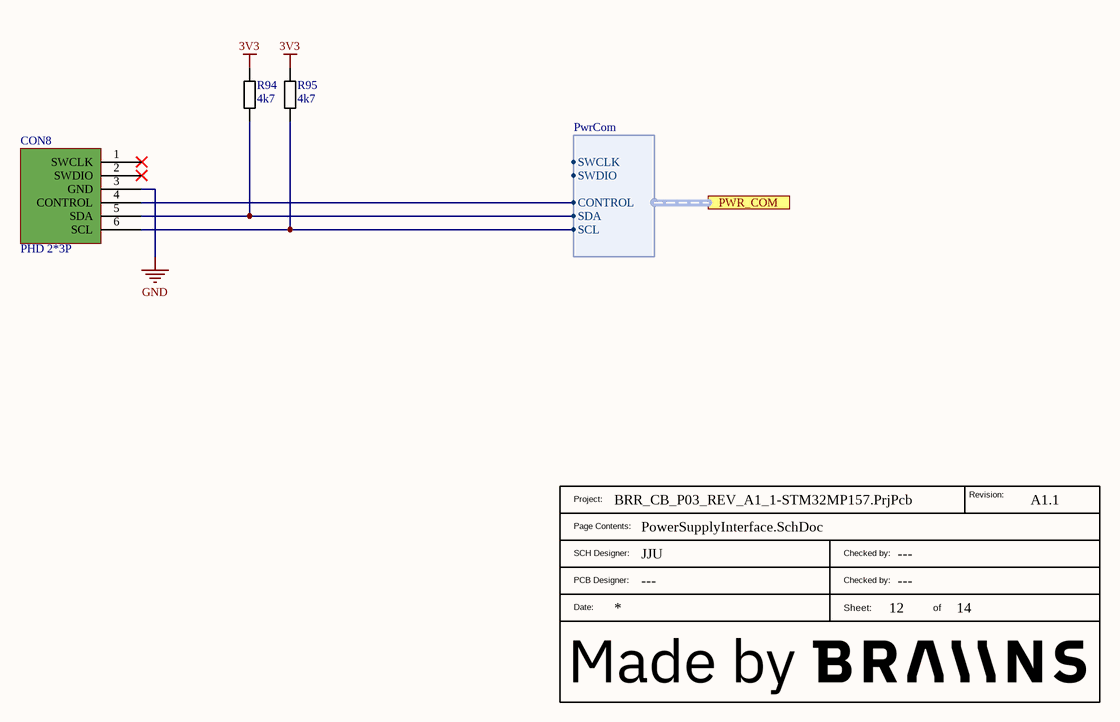
[diagram p11: PowerSupplyInterface.SchDoc]

### Parts
(Parts that share a designator on the sheet are numbered #1, #2 ... from top to bottom, then left to right.)
?#11  BraiinsTitleBlockWithLogo  (value not drawn)  (graphical)
CON8  PHD 2*3P  [C4201WR-2x3P]
R94  4k7  [RES0402]
R95  4k7  [RES0402]

### Ports
PWR_COM (harness PwrCom)

### Harnesses
PwrCom: SWCLK, SWDIO, CONTROL, SDA, SCL

### Nets
3V3: R94.1 R95.1
GND: CON8.3(GND)
I2C2_SCL: CON8.6(SCL) R95.2 ; port PWR_COM.SCL
I2C2_SDA: CON8.5(SDA) R94.2 ; port PWR_COM.SDA
PWR_CONTROL: CON8.4(CONTROL) ; port PWR_COM.CONTROL

Not connected (* = marked no-connect by the designer): CON8 1(SWCLK)* 2(SWDIO)*

### Notes on the sheet
- (in symbol BraiinsTitleBlockWithLogo) Revision:; Project:; Page Contents:; SCH Designer:; Checked by:; PCB Designer:; Date:; Sheet:; of

### Library data of the parts
CON8 = 30148: Miner Power Supply Com Connector 2x3pin; Part_Status: New; ID: 30148; Updated By: janjuranek; Value: PHD 2*3P; Part_Type: Connector; Manufacturer Part Number: PHD 2*3P; Manufacturer Part Description: Miner Power Supply Com Connector 2x3pin; Created By: janjuranek; Created_Date: 2023-04-27 15:30:40; Updated_Date: 2023-06-06 14:52:36; ComponentLink1Description: Datasheet; ComponentLink2Description: Supplier Part Details
R94 R95 = 30073: as R85-R87 on sheet HBInterface; Value: 4k7; Part_Type: Resistor; Manufacturer Part Description: RES 4k7 Ohm 1% 0402; Package_Case: 0402; RoHS: Yes; Tolerance: 1%; Created By: Jan; Created_Date: 2023-03-02 13:15:12; Updated_Date: 2023-03-02 13:15:46; ComponentLink1Description: Datasheet; ComponentLink2Description: Supplier Part Details; Temperature Range: -40 to +150C

## Sheet MPU PWR.SchDoc
size A4; SheetNumber: 13; SheetTotal: 14
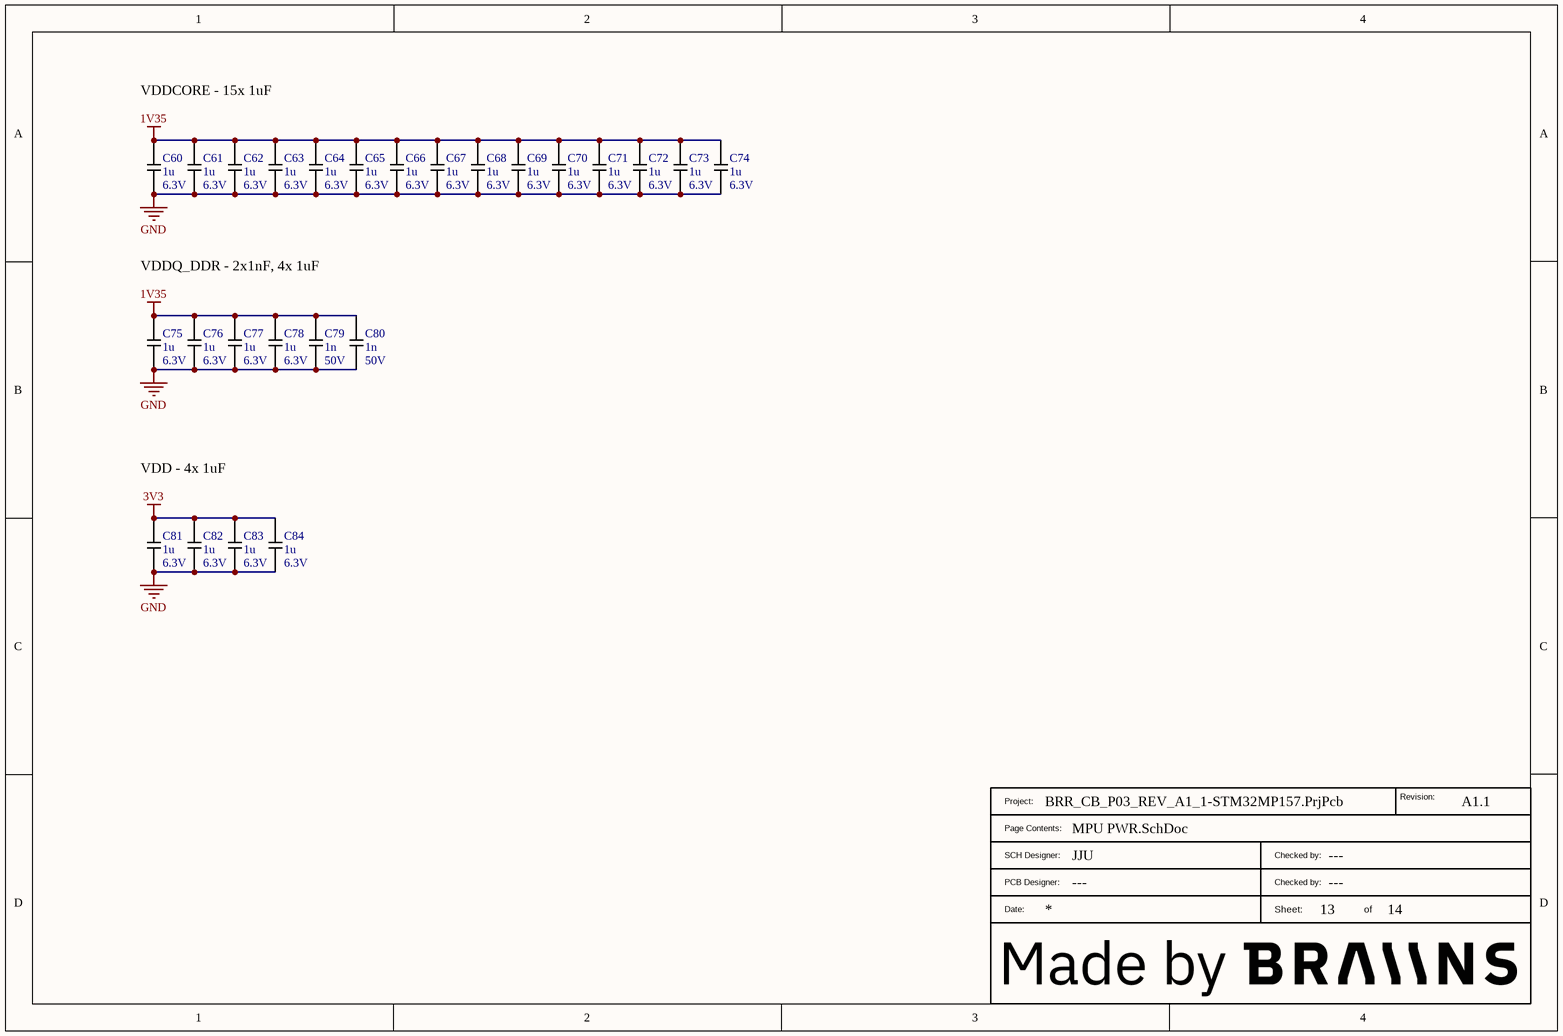
[diagram p12: MPU PWR.SchDoc]

### Parts
(Parts that share a designator on the sheet are numbered #1, #2 ... from top to bottom, then left to right.)
?#12  BraiinsTitleBlockWithLogo  (value not drawn)  (graphical)
C60  Voltage_Rating: 6.3V  [CAP0402]  (hidden comment: 1u)
C61  Voltage_Rating: 6.3V  [CAP0402]  (hidden comment: 1u)
C62  Voltage_Rating: 6.3V  [CAP0402]  (hidden comment: 1u)
C63  Voltage_Rating: 6.3V  [CAP0402]  (hidden comment: 1u)
C64  Voltage_Rating: 6.3V  [CAP0402]  (hidden comment: 1u)
C65  Voltage_Rating: 6.3V  [CAP0402]  (hidden comment: 1u)
C66  Voltage_Rating: 6.3V  [CAP0402]  (hidden comment: 1u)
C67  Voltage_Rating: 6.3V  [CAP0402]  (hidden comment: 1u)
C68  Voltage_Rating: 6.3V  [CAP0402]  (hidden comment: 1u)
C69  Voltage_Rating: 6.3V  [CAP0402]  (hidden comment: 1u)
C70  Voltage_Rating: 6.3V  [CAP0402]  (hidden comment: 1u)
C71  Voltage_Rating: 6.3V  [CAP0402]  (hidden comment: 1u)
C72  Voltage_Rating: 6.3V  [CAP0402]  (hidden comment: 1u)
C73  Voltage_Rating: 6.3V  [CAP0402]  (hidden comment: 1u)
C74  Voltage_Rating: 6.3V  [CAP0402]  (hidden comment: 1u)
C75  Voltage_Rating: 6.3V  [CAP0402]  (hidden comment: 1u)
C76  Voltage_Rating: 6.3V  [CAP0402]  (hidden comment: 1u)
C77  Voltage_Rating: 6.3V  [CAP0402]  (hidden comment: 1u)
C78  Voltage_Rating: 6.3V  [CAP0402]  (hidden comment: 1u)
C79  Voltage_Rating: 50V  [CAP0402]  (hidden comment: 1n)
C80  Voltage_Rating: 50V  [CAP0402]  (hidden comment: 1n)
C81  Voltage_Rating: 6.3V  [CAP0402]  (hidden comment: 1u)
C82  Voltage_Rating: 6.3V  [CAP0402]  (hidden comment: 1u)
C83  Voltage_Rating: 6.3V  [CAP0402]  (hidden comment: 1u)
C84  Voltage_Rating: 6.3V  [CAP0402]  (hidden comment: 1u)

### Nets
1V35: C60.1 C61.1 C62.1 C63.1 C64.1 C65.1 C66.1 C67.1 C68.1 C69.1 C70.1 C71.1 C72.1 C73.1 C74.1 C75.1 C76.1 C77.1 C78.1 C79.1 C80.1
3V3: C81.1 C82.1 C83.1 C84.1
GND: C60.2 C61.2 C62.2 C63.2 C64.2 C65.2 C66.2 C67.2 C68.2 C69.2 C70.2 C71.2 C72.2 C73.2 C74.2 C75.2 C76.2 C77.2 C78.2 C79.2 C80.2 C81.2 C82.2 C83.2 C84.2

### Notes on the sheet
- VDDCORE - 15x 1uF
- VDDQ_DDR - 2x1nF, 4x 1uF
- VDD - 4x 1uF
- (in symbol BraiinsTitleBlockWithLogo) Revision:; Project:; Page Contents:; SCH Designer:; Checked by:; PCB Designer:; Date:; Sheet:; of

### Library data of the parts
C60-C78 C81-C84 = 30155: CAP CER 1u 10% 6.3V X7R 0402; Part_Type: Capacitor; Part_Status: New; ID: 30155; Updated By: janjuranek; Sorted_Value: 1; Value: 1u; Sub_Type: CER; Manufacturer Part Description: CAP CER 1u 10% 6.3V X7R 0402; Package_Case: 0402; RoHS: Yes; Dielectric: X7R; Tolerance: 10%; Created By: janjuranek; Created_Date: 2023-05-01 19:24:23; Updated_Date: 2023-05-01 19:25:09; ComponentLink1Description: Datasheet; ComponentLink2Description: Supplier Part Details
C79 C80 = 30076: CAP CER 1n 10% 50V X7R 0402; Part_Type: Capacitor; Part_Status: New; ID: 30076; Updated By: Jan; Sorted_Value: 1; Value: 1n; Sub_Type: CER; Manufacturer Part Description: CAP CER 1n 10% 50V X7R 0402; Package_Case: 0402; RoHS: Yes; Temperature Range: -40 to +150C; Dielectric: X7R; Tolerance: 10%; Created By: Jan; Created_Date: 2023-03-02 13:25:54; Updated_Date: 2023-03-02 13:26:19; ComponentLink1Description: Datasheet; ComponentLink2Description: Supplier Part Details